# EasyEDA Pro project 21届智能车+蚂蚁搬家+主驱一体PCB文件.epro, schematic Schematic2

## Sheets
1 电源: Board Name: V2.0（20260103）; Create Date: 2025-12-08; Page Name: 电源; Project Name: NXP_micropython主驱一体20251208; Schematic Name: Schematic2; Update Date: 2026-01-03; BladeWidth: 10; Company: 嘉立创EDA; Page Size: A4; RegionStart: 1; ShowBorder: 1; TitleBlock: 1; TitleBlockPosition: 3; Version: V1.0; XRegionCount: 6; YRegionCount: 4
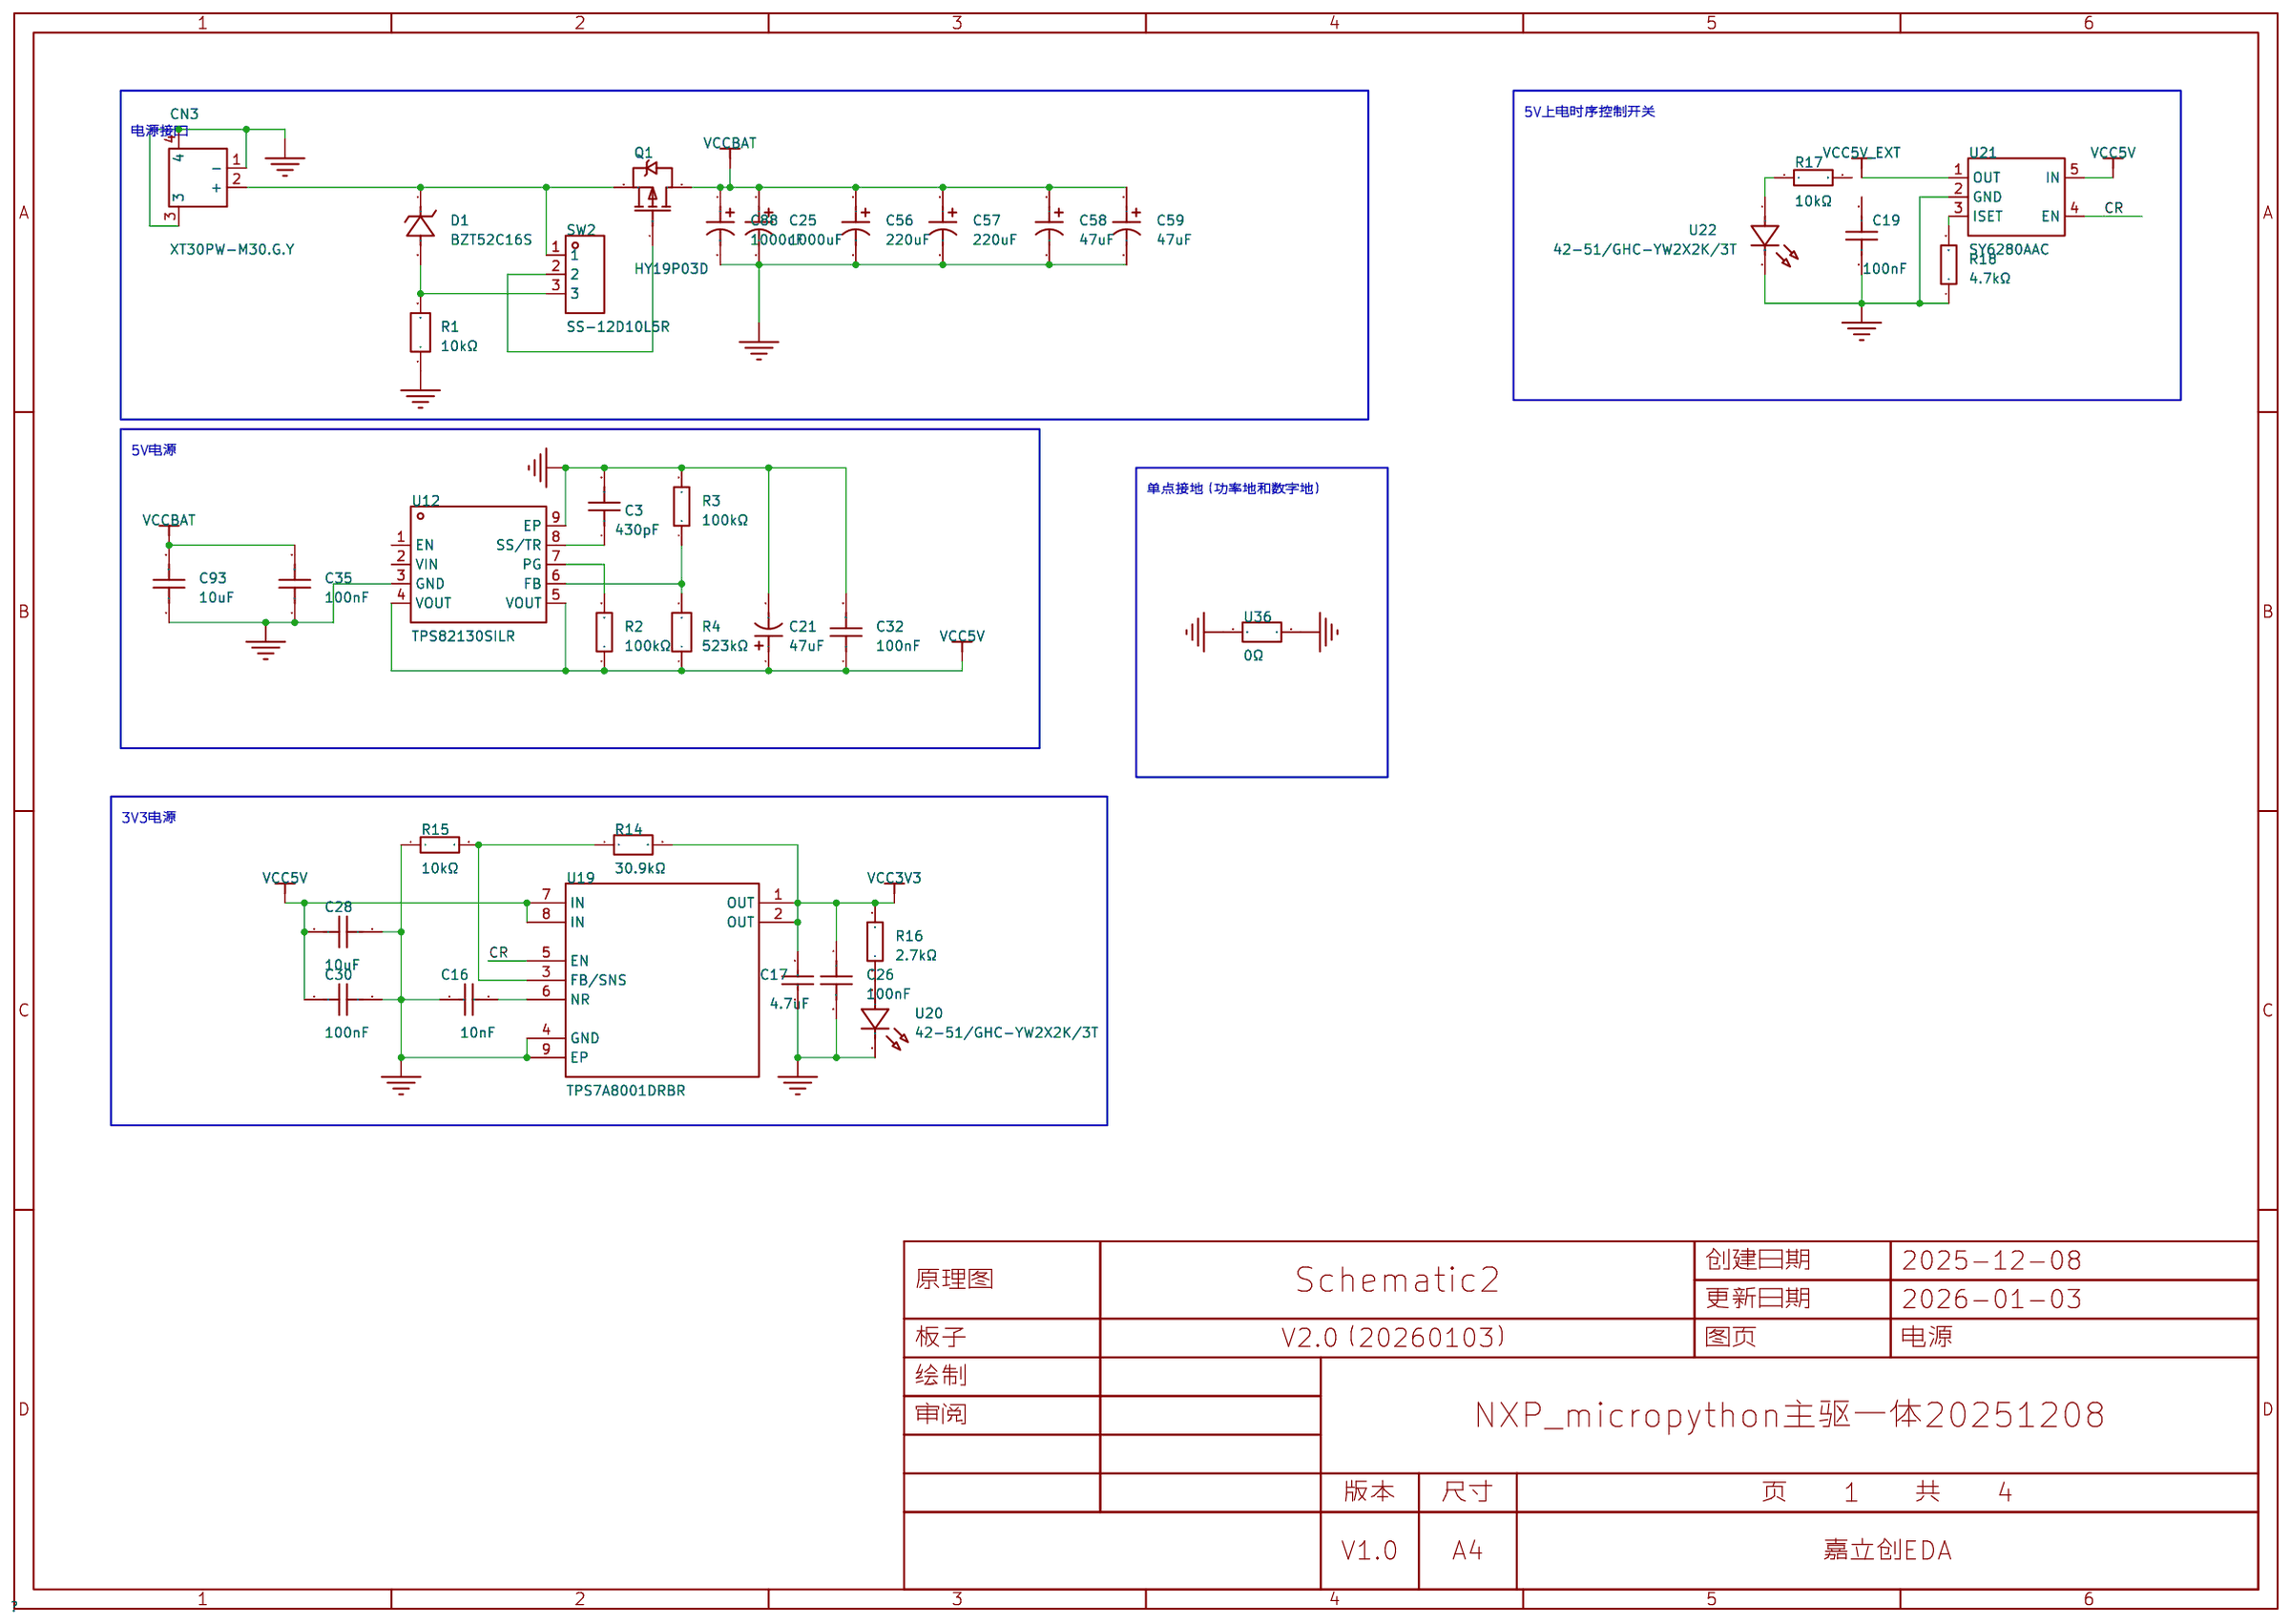
[diagram p23: 电源]
2 外设: Page Name: 外设; Update Date: 2026-01-04
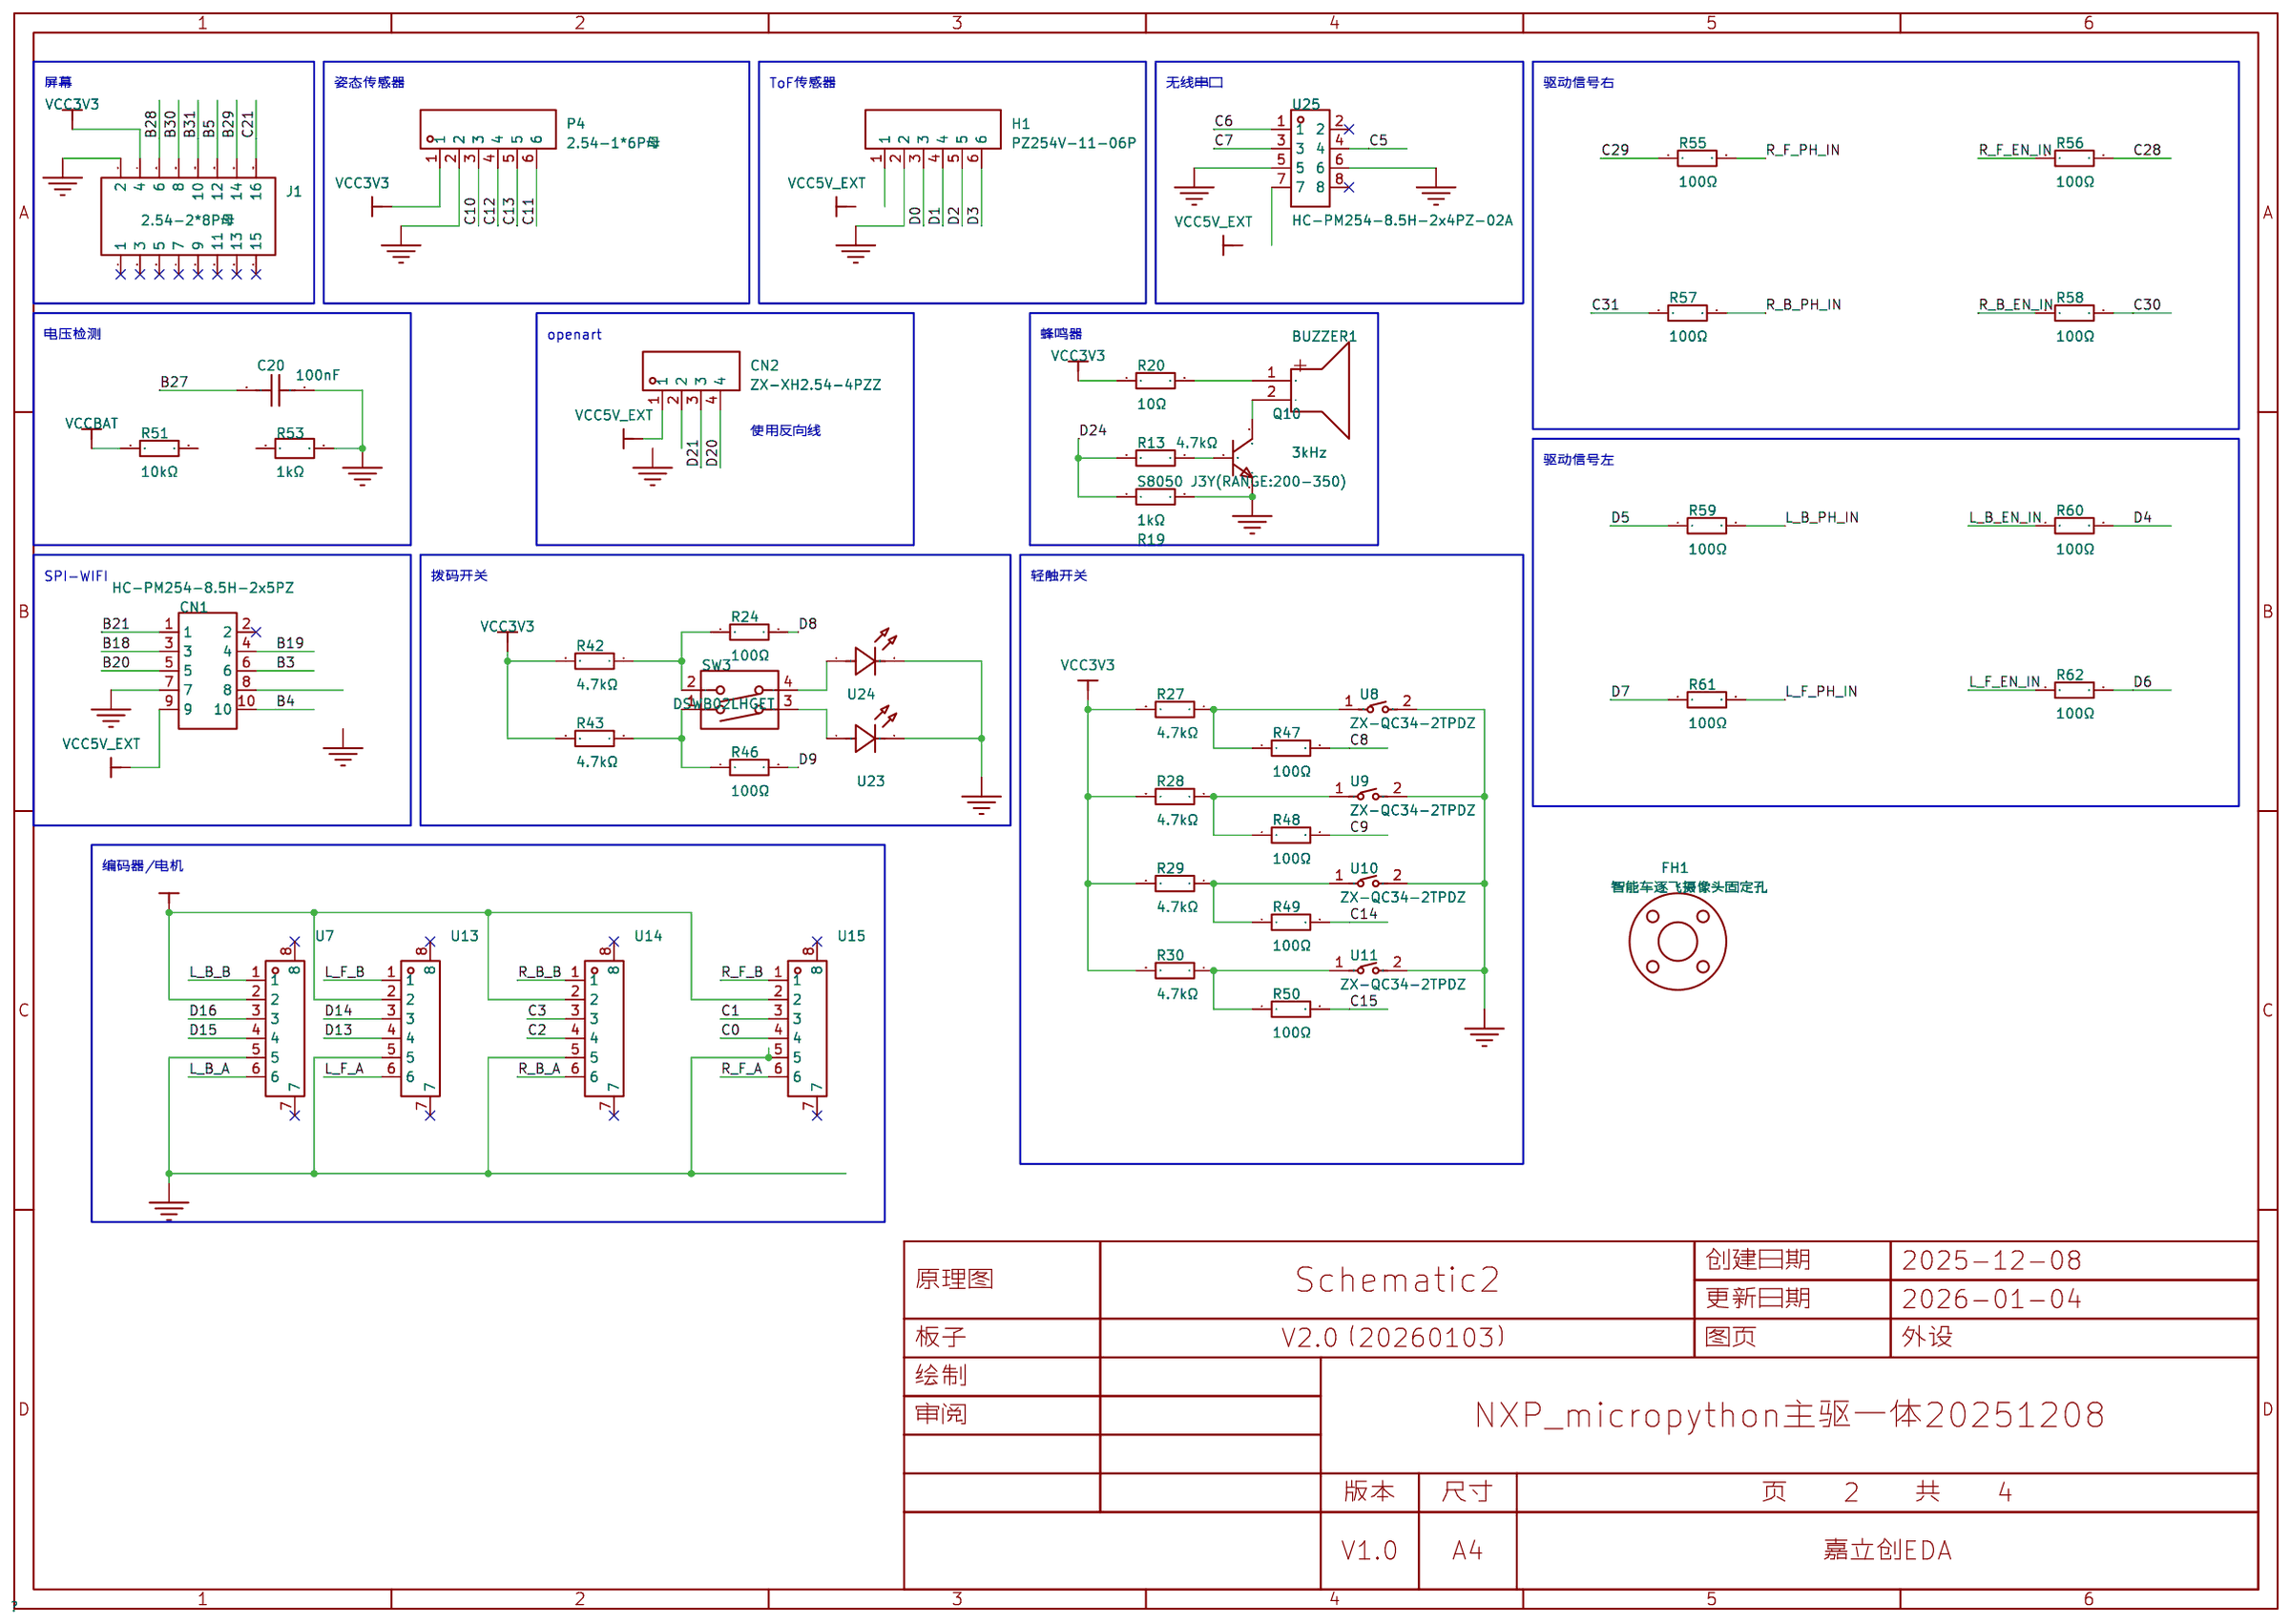
[diagram p24: 外设]
3 核心板: Page Name: 核心板; Update Date: 2026-01-04
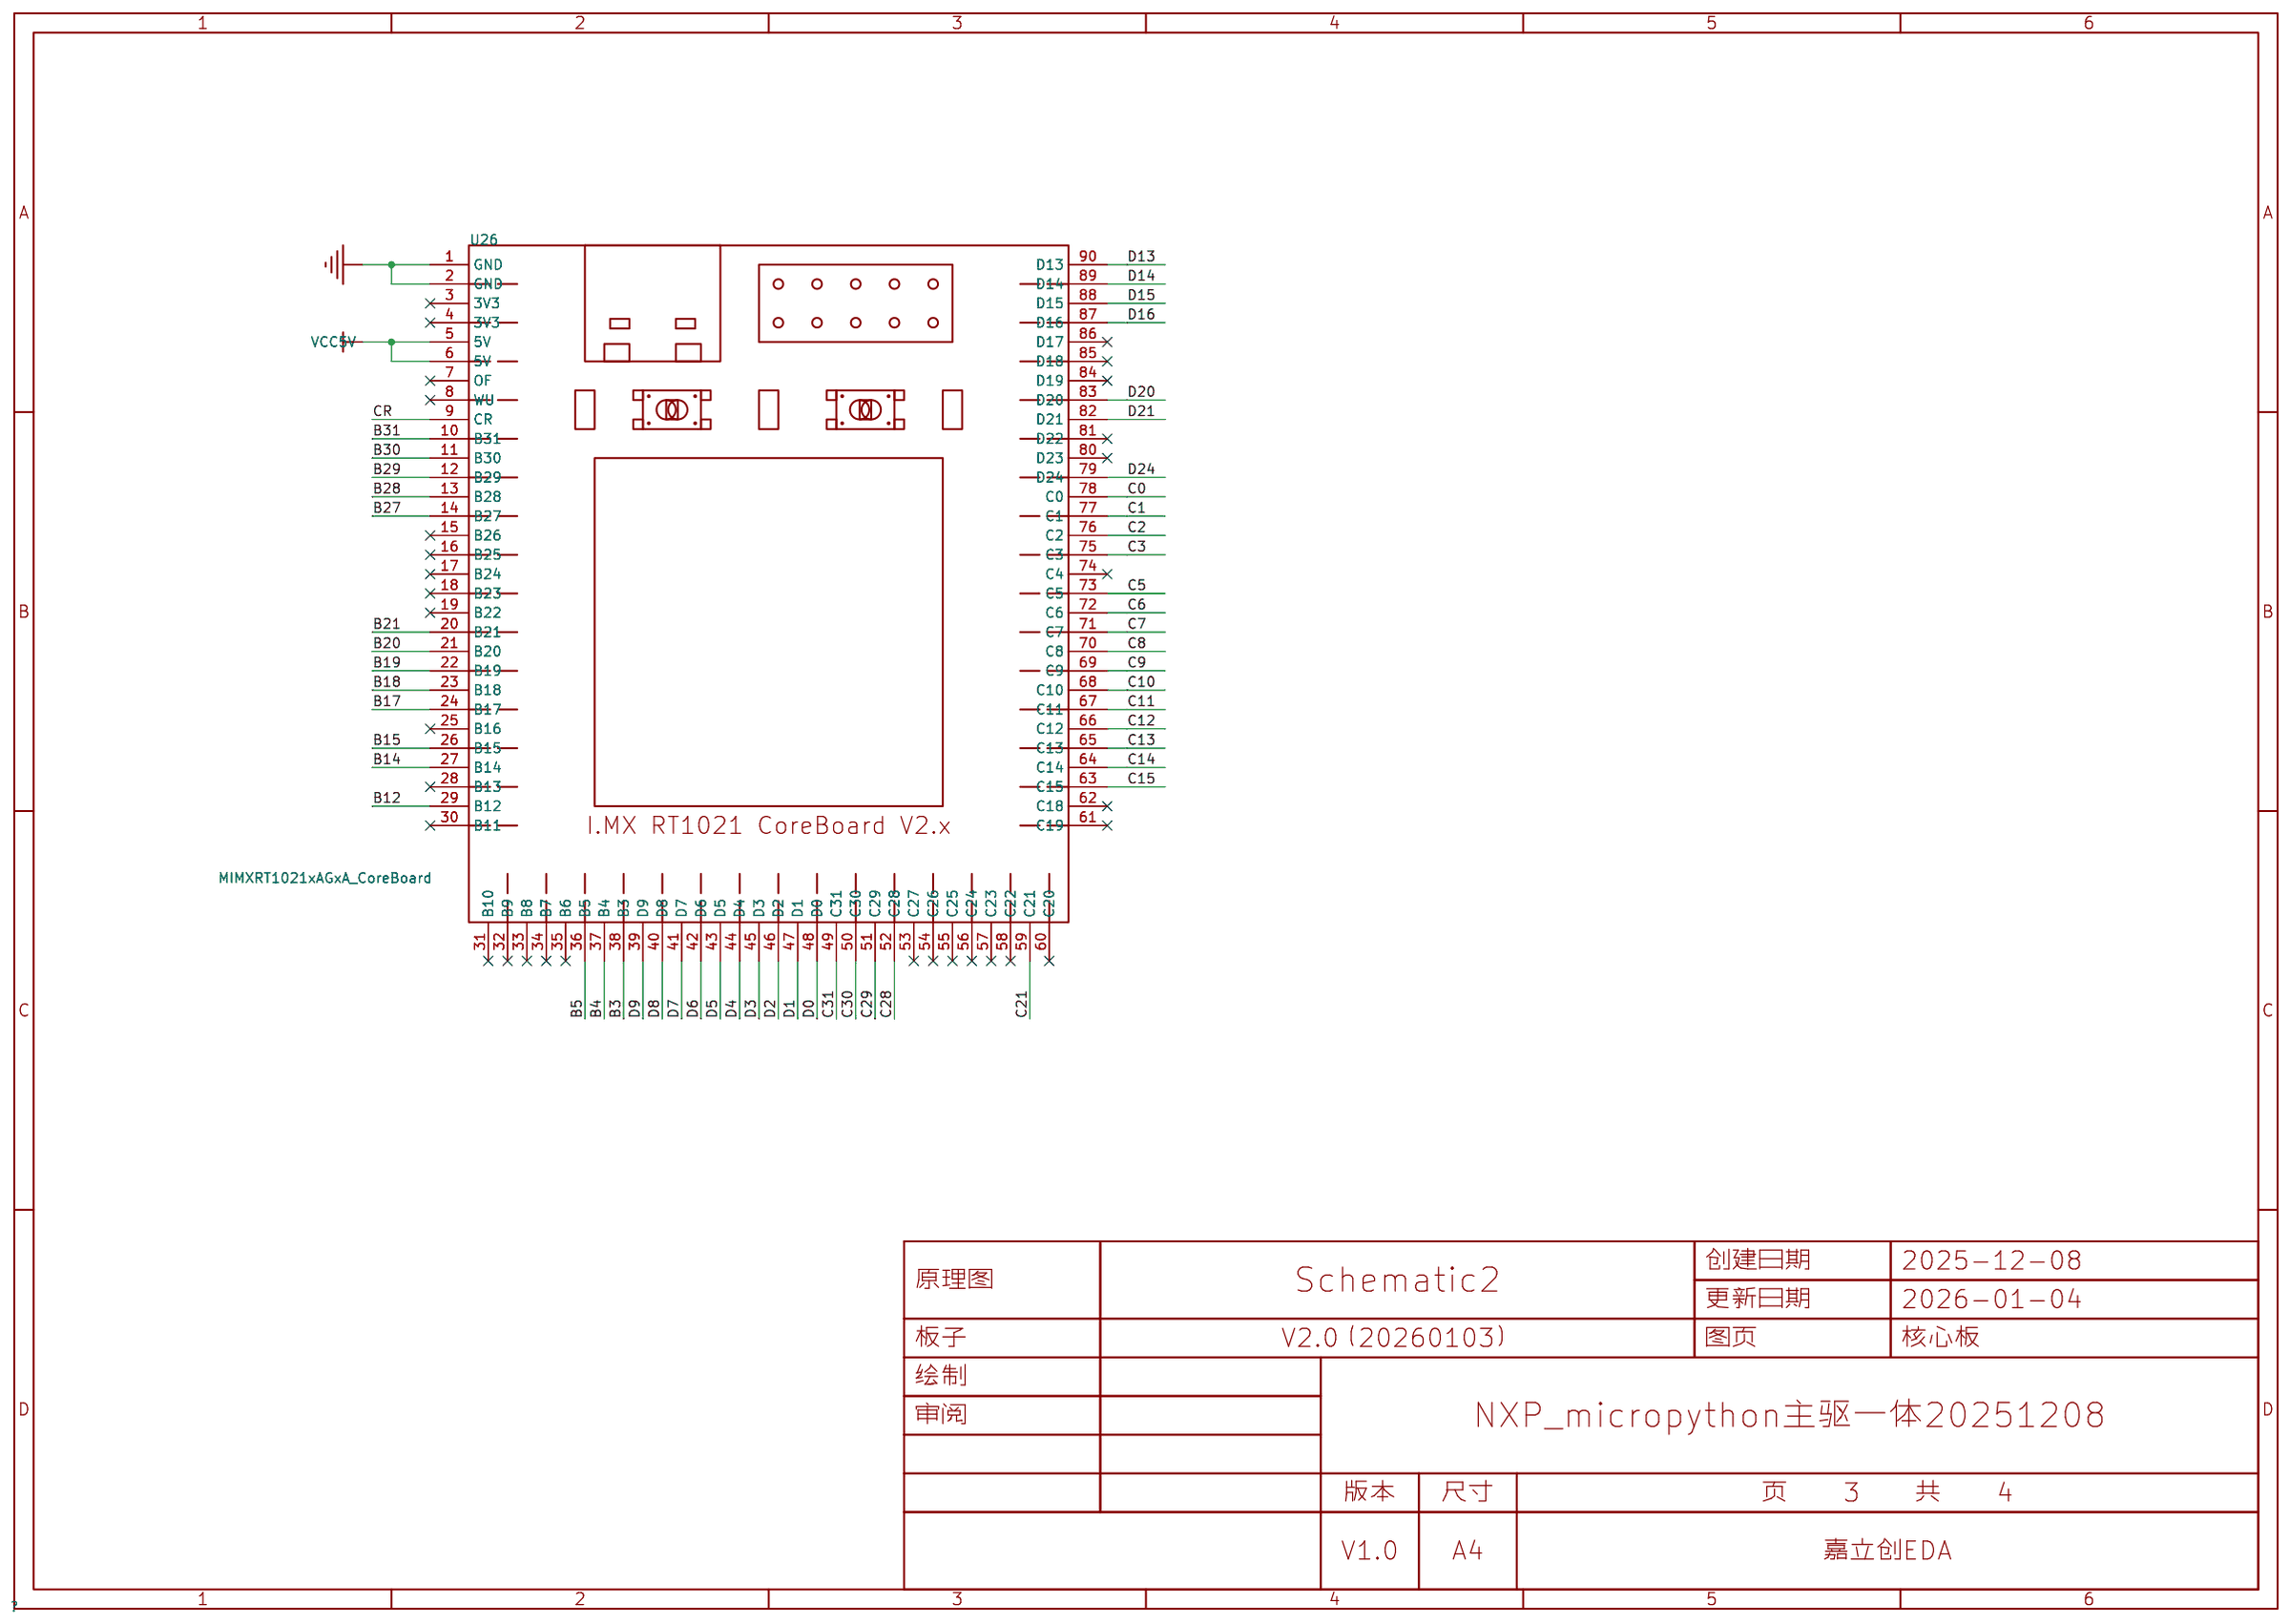
[diagram p25: 核心板]
4 双驱: Page Name: 双驱
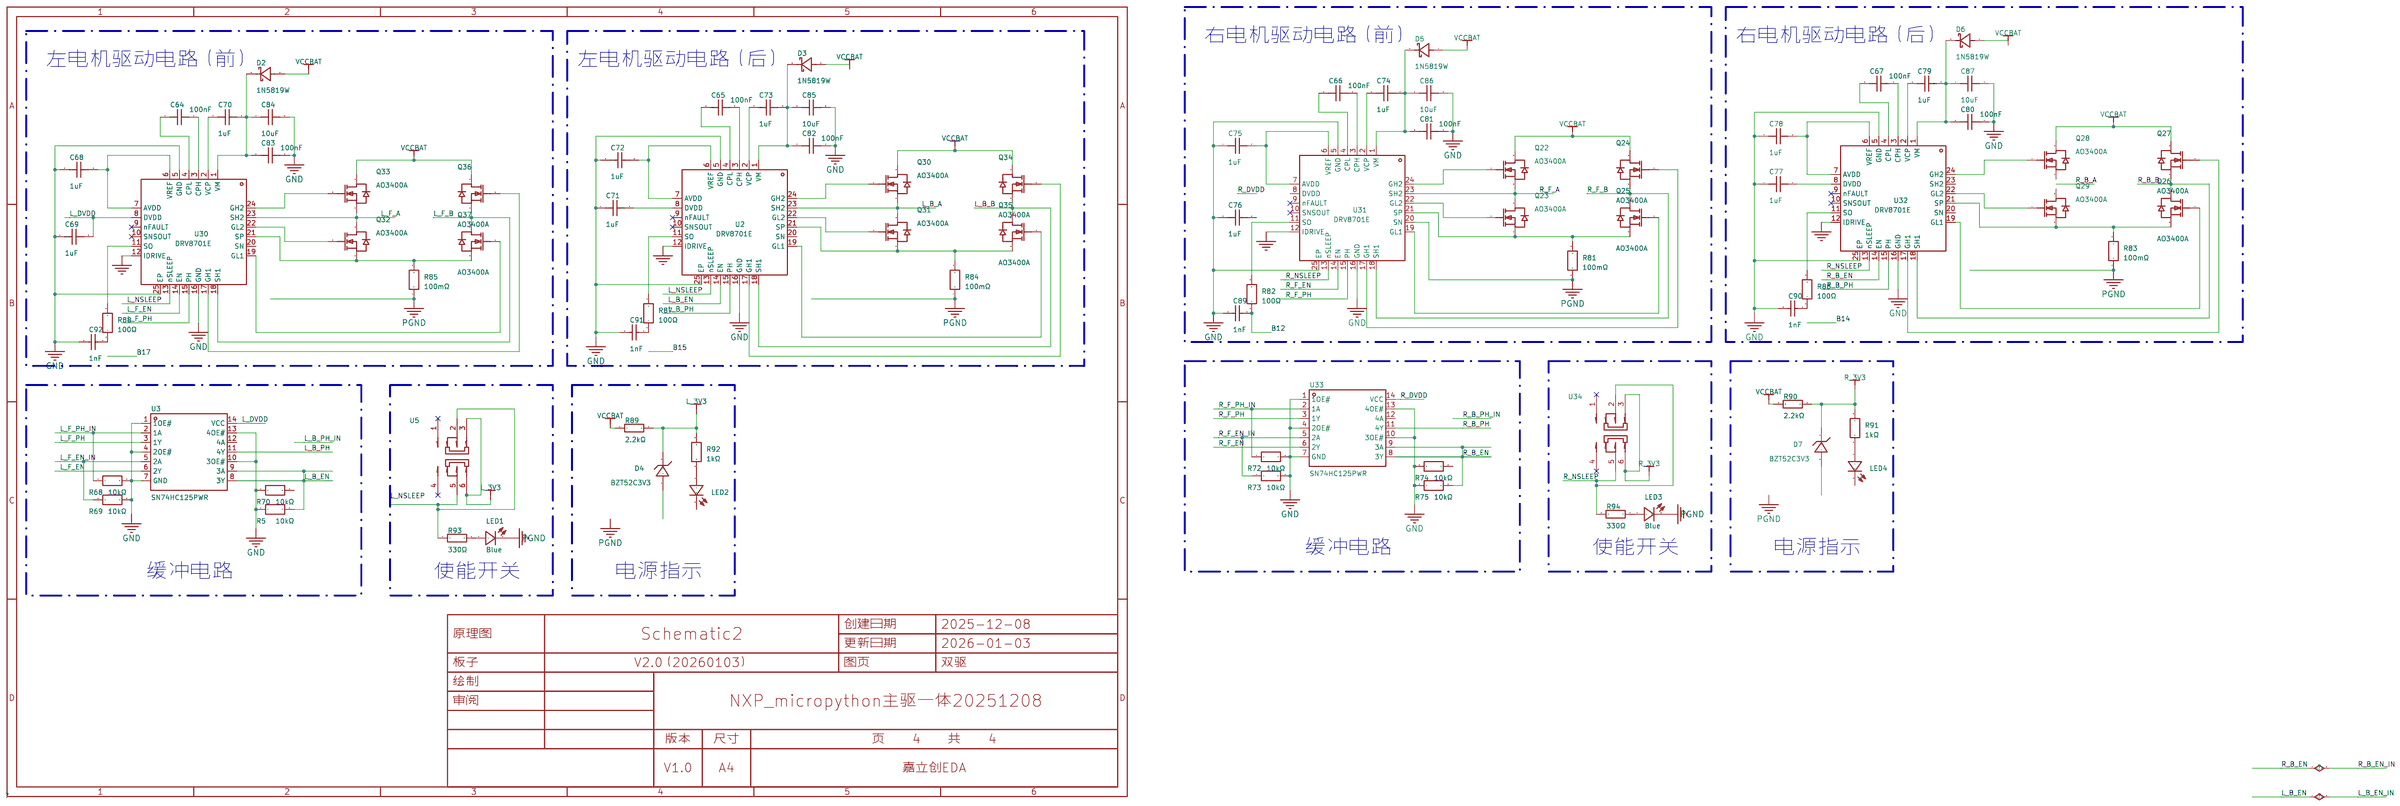
[diagram p26: 双驱]

## Parts
sheet 双驱
C64  100nF  [C0603]
C65  100nF  [C0603]
C66  100nF  [C0603]
C67  100nF  [C0603]
C68  1uF  [C0603]
C69  1uF  [C0603]
C70  1uF  [C0603]
C71  1uF  [C0603]
C72  1uF  [C0603]
C73  1uF  [C0603]
C74  1uF  [C0603]
C75  1uF  [C0603]
C76  1uF  [C0603]
C77  1uF  [C0603]
C78  1uF  [C0603]
C79  1uF  [C0603]
C80  100nF  [C0603]
C81  100nF  [C0603]
C82  100nF  [C0603]
C83  100nF  [C0603]
C84  10uF  [C0603]
C85  10uF  [C0603]
C86  10uF  [C0603]
C87  10uF  [C0603]
C89  1nF  [C0603]
C90  1nF  [C0603]
C91  1nF  [C0603]
C92  1nF  [C0603]
D2  1N5819W  [SOD-123_L2.7-W1.6-LS3.7-R-RD]
D3  1N5819W  [SOD-123_L2.7-W1.6-LS3.7-R-RD]
D4  BZT52C3V3  [SOD-123_L2.8-W1.8-LS3.7-RD]
D5  1N5819W  [SOD-123_L2.7-W1.6-LS3.7-R-RD]
D6  1N5819W  [SOD-123_L2.7-W1.6-LS3.7-R-RD]
D7  BZT52C3V3  [SOD-123_L2.8-W1.8-LS3.7-RD]
LED1  Blue  [LEDC1608(0603)]
LED2  =Color  [LEDC1608(0603)]
LED3  Blue  [LEDC1608(0603)]
LED4  =Color  [LEDC1608(0603)]
Q22  AO3400A  [SOT-23-3_L2.9-W1.3-P1.90-LS2.4-BR]
Q23  AO3400A  [SOT-23-3_L2.9-W1.3-P1.90-LS2.4-BR]
Q24  AO3400A  [SOT-23-3_L2.9-W1.3-P1.90-LS2.4-BR]
Q25  AO3400A  [SOT-23-3_L2.9-W1.3-P1.90-LS2.4-BR]
Q26  AO3400A  [SOT-23-3_L2.9-W1.3-P1.90-LS2.4-BR]
Q27  AO3400A  [SOT-23-3_L2.9-W1.3-P1.90-LS2.4-BR]
Q28  AO3400A  [SOT-23-3_L2.9-W1.3-P1.90-LS2.4-BR]
Q29  AO3400A  [SOT-23-3_L2.9-W1.3-P1.90-LS2.4-BR]
Q30  AO3400A  [SOT-23-3_L2.9-W1.3-P1.90-LS2.4-BR]
Q31  AO3400A  [SOT-23-3_L2.9-W1.3-P1.90-LS2.4-BR]
Q32  AO3400A  [SOT-23-3_L2.9-W1.3-P1.90-LS2.4-BR]
Q33  AO3400A  [SOT-23-3_L2.9-W1.3-P1.90-LS2.4-BR]
Q34  AO3400A  [SOT-23-3_L2.9-W1.3-P1.90-LS2.4-BR]
Q35  AO3400A  [SOT-23-3_L2.9-W1.3-P1.90-LS2.4-BR]
Q36  AO3400A  [SOT-23-3_L2.9-W1.3-P1.90-LS2.4-BR]
Q37  AO3400A  [SOT-23-3_L2.9-W1.3-P1.90-LS2.4-BR]
R5  10kΩ  [R0805]
R68  10kΩ  [R0805]
R69  10kΩ  [R0805]
R70  10kΩ  [R0805]
R72  10kΩ  [R0805]
R73  10kΩ  [R0805]
R74  10kΩ  [R0805]
R75  10kΩ  [R0805]
R81  100mΩ  [RES-SMD_L6.4-W3.2-R2512]
R82  100Ω  [R0603]
R83  100mΩ  [RES-SMD_L6.4-W3.2-R2512]
R84  100mΩ  [RES-SMD_L6.4-W3.2-R2512]
R85  100mΩ  [RES-SMD_L6.4-W3.2-R2512]
R86  100Ω  [R0603]
R87  100Ω  [R0603]
R88  100Ω  [R0603]
R89  2.2kΩ  [R0603]
R90  2.2kΩ  [R0603]
R91  1kΩ  [R0603]
R92  1kΩ  [R0603]
R93  330Ω  [R0603]
R94  330Ω  [R0603]
U2  DRV8701E  [VQFN-24_L4.0-W4.0-P0.50-BL-EP2.5]
U3  SN74HC125PWR  [TSSOP-14_L5.0-W4.4-P0.65-LS6.5-BL]
U5  SS-3235S-L1  [SW-SMD_SS-3235S-LX]
U30  DRV8701E  [VQFN-24_L4.0-W4.0-P0.50-BL-EP2.5]
U31  DRV8701E  [VQFN-24_L4.0-W4.0-P0.50-BL-EP2.5]
U32  DRV8701E  [VQFN-24_L4.0-W4.0-P0.50-BL-EP2.5]
U33  SN74HC125PWR  [TSSOP-14_L5.0-W4.4-P0.65-LS6.5-BL]
U34  SS-3235S-L1  [SW-SMD_SS-3235S-LX]
sheet 外设
BUZZER1  3kHz  [BUZ-TH_BD9.0-P5.00-D0.6-FD]
C20  100nF  [C0603]
CN1  HC-PM254-8.5H-2x5PZ  [HDR-TH_10P-P2.54-V-F-R2-C5-S2.54-1]
CN2  ZX-XH2.54-4PZZ  [CONN-TH_4P-P2.50_4PIN]
FH1  智能车逐飞摄像头固定孔  [智能车逐飞摄像头支架固定孔]
H1  PZ254V-11-06P  [HDR-TH_6P-P2.54-V-M]
J1  2.54-2*8P母  [HDR-TH_16P-P2.54-V-F-R2-C8-S2.54]
P4  2.54-1*6P母  [HDR-TH_6P-P2.54-V-F]
Q10  S8050 J3Y(RANGE:200-350)  [SOT-23-3_L3.0-W1.7-P0.95-LS2.9-BR]
R13  4.7kΩ  [R0603]
R19  1kΩ  [R0603]
R20  10Ω  [R0603]
R24  100Ω  [R0603]
R27  4.7kΩ  [R0603]
R28  4.7kΩ  [R0603]
R29  4.7kΩ  [R0603]
R30  4.7kΩ  [R0603]
R42  4.7kΩ  [R0603]
R43  4.7kΩ  [R0603]
R46  100Ω  [R0603]
R47  100Ω  [R0603]
R48  100Ω  [R0603]
R49  100Ω  [R0603]
R50  100Ω  [R0603]
R51  10kΩ  [R0603]
R53  1kΩ  [R0603]
R55  100Ω  [R0603]
R56  100Ω  [R0603]
R57  100Ω  [R0603]
R58  100Ω  [R0603]
R59  100Ω  [R0603]
R60  100Ω  [R0603]
R61  100Ω  [R0603]
R62  100Ω  [R0603]
SW3  DSWB02LHGET  [SW-TH_DSWB02LHGET]
U7  ZX-ZH1.5-6PWT  [CONN-SMD_6P-P1.50_ZX-ZH1.5-6PWT]
U8  ZX-QC34-2TPDZ  [KEY-SMD_L3.9-W3.0-LS5.0-EH]
U9  ZX-QC34-2TPDZ  [KEY-SMD_L3.9-W3.0-LS5.0-EH]
U10  ZX-QC34-2TPDZ  [KEY-SMD_L3.9-W3.0-LS5.0-EH]
U11  ZX-QC34-2TPDZ  [KEY-SMD_L3.9-W3.0-LS5.0-EH]
U13  ZX-ZH1.5-6PWT  [CONN-SMD_6P-P1.50_ZX-ZH1.5-6PWT]
U14  ZX-ZH1.5-6PWT  [CONN-SMD_6P-P1.50_ZX-ZH1.5-6PWT]
U15  ZX-ZH1.5-6PWT  [CONN-SMD_6P-P1.50_ZX-ZH1.5-6PWT]
U23  42-51/GHC-YW2X2K/3T  [LED-SMD_L1.6-W0.8-FD_GREEN-1]
U24  42-51/GHC-YW2X2K/3T  [LED-SMD_L1.6-W0.8-FD_GREEN-1]
U25  HC-PM254-8.5H-2x4PZ-02A  [HDR-TH_8P-P2.54-V-F-R2-C4-S2.54]
sheet 核心板
U26  MIMXRT1021xAGxA_CoreBoard  [MIMXRT1021xAGxA_CoreBoard_V2.x]
sheet 电源
C3  430pF  [C0603]
C16  10nF  [C0805]
C17  4.7uF  [C0805]
C19  100nF  [C0603]
C21  47uF  [CAP-SMD_BD5.0-L5.3-W5.3-LS5.9-FD]
C25  1000uF  [CAP-TH_BD10.0-P5.00-D0.6-FD]
C26  100nF  [C0603]
C28  10uF  [C0805]
C30  100nF  [C0603]
C32  100nF  [C0603]
C35  100nF  [C0603]
C56  220uF  [CAP-SMD_BD6.3-L6.6-W6.6-LS7.3-FD-H7.7]
C57  220uF  [CAP-SMD_BD6.3-L6.6-W6.6-LS7.3-FD-H7.7]
C58  47uF  [CAP-SMD_BD5.0-L5.3-W5.3-LS5.9-FD]
C59  47uF  [CAP-SMD_BD5.0-L5.3-W5.3-LS5.9-FD]
C88  1000uF  [CAP-TH_BD10.0-P5.00-D0.6-FD]
C93  10uF  [C0603]
CN3  XT30PW-M30.G.Y  [CONN-TH_XT30PW-M]
D1  BZT52C16S  [SOD-323_L1.7-W1.3-LS2.6-RD]
Q1  HY19P03D  [TO-252-2_L6.6-W6.1-P4.57-LS9.9-TL-CW]
R1  10kΩ  [R0603]
R2  100kΩ  [R0603]
R3  100kΩ  [R0603]
R4  523kΩ  [R0603]
R14  30.9kΩ  [R0603]
R15  10kΩ  [R0603]
R16  2.7kΩ  [R0603]
R17  10kΩ  [R0603]
R18  4.7kΩ  [R0603]
SW2  SS-12D10L5R  [SW-TH_SS-12D10L9]
U12  TPS82130SILR  [USIP-8_L3.0-W2.8-P0.65-TL-EP]
U19  TPS7A8001DRBR  [VSON-8_L3.0-W3.0-P0.65-TL-EP]
U20  42-51/GHC-YW2X2K/3T  [LED-SMD_L1.6-W0.8-FD_GREEN-1]
U21  SY6280AAC  [SOT-23-5_L3.0-W1.7-P0.95-LS2.8-BR]
U22  42-51/GHC-YW2X2K/3T  [LED-SMD_L1.6-W0.8-FD_GREEN-1]
U36  0Ω  [R1206]

## Library data of the parts
C19 C20 C26 C30 C32 C35 C64-C67 C80-C83 = CL10B104KB8NNNC: 容值:100nF;精度:±10%;额定电压:50V;温度系数:X7R;; LCSC Part Name: 100nF ±10% 50V; Supplier Part: C1591; Manufacturer: SAMSUNG(三星); Supplier Footprint: 0603; JLCPCB Part Class: 扩展库; Datasheet: https://item.szlcsc.com/datasheet/CL10B104KB8NNNC/1943.html; Supplier: LCSC; Tolerance: ±10%; Voltage Rating: 50V; Temperature Coefficient: X7R
C68-C79 = CGA0603X5R105K500JT: 容值:1uF;精度:±10%;额定电压:50V;温度系数:X5R;; LCSC Part Name: 1uF ±10% 50V; Supplier Part: C6119852; Manufacturer: HRE(芯声); Supplier Footprint: 0603; JLCPCB Part Class: 扩展库; Datasheet: https://item.szlcsc.com/datasheet/CGA0603X5R105K500JT/7062558.html; Supplier: LCSC; Tolerance: ±10%; Voltage Rating: 50V; Temperature Coefficient: X5R
C84-C87 C93 = CL10A106MA8NRNC: 容值:10uF;精度:±20%;额定电压:25V;温度系数:X5R;; LCSC Part Name: 10uF ±20% 25V; Supplier Part: C96446; Manufacturer: SAMSUNG(三星); Supplier Footprint: 0603; JLCPCB Part Class: 基础库; Datasheet: https://item.szlcsc.com/datasheet/CL10A106MA8NRNC/97651.html; Supplier: LCSC; Tolerance: ±20%; Voltage Rating: 25V; Temperature Coefficient: X5R
C89-C92 = CL10B102KB8NNNC: 容值:1nF;精度:±10%;额定电压:50V;温度系数:X7R;; LCSC Part Name: 1nF ±10% 50V; Supplier Part: C1588; Manufacturer: SAMSUNG(三星); Supplier Footprint: 0603; JLCPCB Part Class: 基础库; Datasheet: https://item.szlcsc.com/datasheet/CL10B102KB8NNNC/1940.html; Supplier: LCSC; Tolerance: ±10%; Voltage Rating: 50V; Temperature Coefficient: X7R
D2 D3 D5 D6 = 1N5819W_C963381: 二极管配置:独立式;直流反向耐压(Vr):40V;平均整流电流(Io):350mA;正向压降(Vf):600mV@200mA;反向电流(Ir):5uA@30V;; LCSC Part Name: 40V 350mA 600mV@200mA; Supplier Part: C963381; Manufacturer: JSMSEMI(杰盛微); Supplier Footprint: SOD-123; JLCPCB Part Class: 扩展库; Datasheet: https://atta.szlcsc.com/upload/public/pdf/source/20211201/C266112E93E924DFE0C071C9A8E85281.pdf; Supplier: LCSC; Diode Configuration: 独立式; Reverse Voltage (Vr): 40V; Average Rectified Current (Io): 350mA; Forward Voltage (Vf@If): 600mV@200mA; Reverse Leakage Current (Ir): 5uA@30V
D4 D7 = BZT52C3V3_C2112: 二极管配置:独立式;稳压值(标称值):3.3V;稳压值(范围):3.1V~3.5V;精度:-;功率:350mW;反向电流(Ir):5uA@1V;阻抗(Zzt):95Ω;; LCSC Part Name: 3.3V 350mW; Supplier Part: C2112; Manufacturer: CJ(江苏长电/长晶); Supplier Footprint: SOD-123; JLCPCB Part Class: Extended Part; Datasheet: https://atta.szlcsc.com/upload/public/pdf/source/20170919/C2112_1505799672426977594.pdf; Supplier: LCSC; Diode Configuration: 独立式; Zener Voltage (Nom): 3.3V; Zener Voltage (Range): 3.1V~3.5V; Power Dissipation: 350mW; Reverse Leakage Current (Ir): 5uA@1V; Zener Impedance (Zzt): 95Ω
LED1 LED3 = LED Chip Blue: Published: 8-Jun-2000; Revision: July-2002: Re-released for DXP Platform.; Publisher: Altium Limited; Price(RMB): 0.00; Origin Footprint 2: LEDC2012(0805); Origin Footprint 3: LEDC3216(1206)
LED2 LED4 = LED Chip Red: Published: 8-Jun-2000; Revision: July-2002: Re-released for DXP Platform.; Publisher: Altium Limited; Price(RMB): 0.00; Origin Footprint 2: LEDC2012(0805); Origin Footprint 3: LEDC3216(1206)
Q22-Q37 = AO3400A_C20917: 数量:-;漏源电压(Vdss):30V;连续漏极电流(Id):-;导通电阻(RDS(on)):48mΩ@2.5V;耗散功率(Pd):-;阈值电压(Vgs(th)):1.45V@250uA;; LCSC Part Name: 1个N沟道 耐压:30V 电流:5.7A; Supplier Part: C20917; Manufacturer: AOS; Supplier Footprint: SOT-23-3L; JLCPCB Part Class: 基础库; Datasheet: https://item.szlcsc.com/datasheet/AO3400A/21629.html; Supplier: LCSC; Drain to Source Voltage: 30V; RDS(on): 48mΩ@2.5V; Gate Threshold Voltage (Vgs(th)): 1.45V@250uA; Gate Charge(Qg): 7nC@10V; Input Capacitance(Ciss): 630pF@15V; Operating Temperature: -55℃~+150℃@(Tj); Type: N沟道
R5 R68-R70 R72-R75 = ERJP06J103V: 阻值:10kΩ;精度:±5%;功率:500mW;温度系数:±200ppm/℃;最大工作电压:600V;工作温度范围:-55℃~+155℃;; LCSC Part Name: 10kΩ ±5% 500mW; Supplier Part: C441955; Manufacturer: PANASONIC(松下); Supplier Footprint: 0805; JLCPCB Part Class: Extended Part; Supplier: LCSC; Tolerance: ±5%; Power(Watts): 500mW; Temperature Coefficient: ±200ppm/℃; Overload Voltage (Max): 600V; Operating Temperature Range: -55℃~+155℃
R81 R83-R85 = HoJLR2512-3W-100mR-1%: 电阻类型:采样电阻;阻值:100mΩ;精度:±1%;功率:3W;安装方式:贴片;; LCSC Part Name: 100mΩ ±1% 3W; Supplier Part: C2903476; Manufacturer: Milliohm(毫欧); Supplier Footprint: 2512; JLCPCB Part Class: 扩展库; Datasheet: https://item.szlcsc.com/datasheet/HoJLR2512-3W-100mR-1%2525/3159230.html; Supplier: LCSC; Type: 采样电阻; Tolerance: ±1%; Power(Watts): 3W; Mounting Type: 贴片
R82 R86-R88 = RCA03100RJLF: 阻值:100Ω;精度:±5%;功率:100mW;; LCSC Part Name: 100Ω ±5% 100mW; Supplier Part: C22356621; Manufacturer: HKR(香港电阻); Supplier Footprint: 0603; JLCPCB Part Class: 扩展库; Datasheet: https://item.szlcsc.com/datasheet/RCA03100RJLF/23790065.html; Supplier: LCSC; Tolerance: ±5%; Power(Watts): 100mW
R89 R90 = 0603WAF2201T5E: 电阻类型:厚膜电阻;阻值:2.2kΩ;精度:±1%;功率:100mW;最大工作电压:75V;温度系数:±100ppm/℃;; LCSC Part Name: 2.2kΩ ±1% 100mW 厚膜电阻; Supplier Part: C4190; Manufacturer: UNI-ROYAL(厚声); Supplier Footprint: 0603; JLCPCB Part Class: 基础库; Datasheet: https://atta.szlcsc.com/upload/public/pdf/source/20200306/C422600_1E6D84923E4A46A82E41ADD87F860B5C.pdf; Supplier: LCSC; Type: 厚膜电阻; Tolerance: ±1%; Power(Watts): 100mW; Overload Voltage (Max): 75V; Temperature Coefficient: ±100ppm/℃; Operating Temperature Range: -55℃~+155℃
R53 R91 R92 = FRC0603F1001TS: 电阻类型:厚膜电阻;阻值:1kΩ;精度:±1%;功率:100mW;工作电压:75V;温度系数:±100ppm/℃;; LCSC Part Name: 1kΩ ±1% 100mW 厚膜电阻; Supplier Part: C2907002; Manufacturer: FOJAN(富捷); Supplier Footprint: 0603; JLCPCB Part Class: 扩展库; Supplier: LCSC; Type: 厚膜电阻; Tolerance: ±1%; Power(Watts): 100mW; Voltage-Supply(Max): 75V; Temperature Coefficient: ±100ppm/℃; Operating Temperature: -55℃~+155℃
R93 R94 = 0603WAF3300T5E: 电阻类型:厚膜电阻;阻值:330Ω;精度:±1%;功率:100mW;最大工作电压:75V;温度系数:±100ppm/℃;; LCSC Part Name: 330Ω ±1% 100mW 厚膜电阻; Supplier Part: C23138; Manufacturer: UNI-ROYAL(厚声); Supplier Footprint: 0603; JLCPCB Part Class: 基础库; Datasheet: https://atta.szlcsc.com/upload/public/pdf/source/20200306/C422600_1E6D84923E4A46A82E41ADD87F860B5C.pdf; Supplier: LCSC; Type: 厚膜电阻; Tolerance: ±1%; Power(Watts): 100mW; Overload Voltage (Max): 75V; Temperature Coefficient: ±100ppm/℃; Operating Temperature Range: -55℃~+155℃
U2 U30-U32 = DRV8701ERGET: 电源电压:0V~5.5V;输出电流:-;接口:并行;; Supplier Part: C132049; Manufacturer: TI(德州仪器); Supplier Footprint: VQFN-24(4x4); JLCPCB Part Class: Extended Part; Datasheet: https://atta.szlcsc.com/upload/public/pdf/source/20170925/C132049_1506321643935990409.pdf; Supplier: LCSC; Type: 有刷直流电机; Supply Voltage: 0V~5.5V; Interface: 并行; Operating Temperature: -40℃~+125℃@(Ta)
U3 U33 = SN74HC125PWR: 类型:缓冲器，非反相;电源电压:2V~6V;输入类型:-;输出类型:三态;低电平输出电流(IOL):7.8mA;高电平输出电流(IOH):7.8mA;工作温度:-40℃~+85℃;; Supplier Part: C132994; Manufacturer: TI(德州仪器); Supplier Footprint: TSSOP-14; JLCPCB Part Class: Extended Part; Datasheet: https://atta.szlcsc.com/upload/public/pdf/source/20170930/C132994_1506736365150997346.pdf; Supplier: LCSC; Type: 缓冲器，非反相; Supply Voltage: 2V~6V; output type: 三态; Current-OutputLow: 7.8mA; Current-OutputHigh: 7.8mA; Operating temperature: -40℃~+85℃
U5 U34 = SS-3235S-L1: 电路结构:双刀双掷;安装方式:卧贴;开关颜色:黑色;额定电流:50mA;额定电压:12V;工作寿命:1万次;; LCSC Part Name: 柄长2mm 卧贴双档 滑动开关; Supplier Part: C500055; Manufacturer: XKB Connection(中国星坤); Supplier Footprint: SMD,9.1x3.6mm; JLCPCB Part Class: 扩展库; Datasheet: https://item.szlcsc.com/datasheet/SS-3235S-L1/512181.html; Supplier: LCSC; Circuit: 双刀双掷; Actuator Style: 矩形柱状; Termination Style: 鸥翼型; Length: 9.1mm; Width: 3.55mm; Switch Height: 3.2mm; Mounting Type: 卧贴; Actuator Color: 黑色; Current Rating: 50mA; Voltage Rating: 12V; Life: 1万次; Operating Temperature: -40℃~+85℃
BUZZER1 = HNB09A03: 驱动方式:有源(内含驱动线路);构造类型:电磁式;频率:3kHz;声压(SPL):85dB;; LCSC Part Name: 电磁式有源一体蜂鸣器HNB09A03; Supplier Part: C96102; Manufacturer: 华能; Supplier Footprint: 插件,D=9mm; JLCPCB Part Class: 扩展库; Datasheet: https://atta.szlcsc.com/upload/public/pdf/source/20241128/61C4C8C3938BB25F7C38FBE94CCE8DCF.pdf; Supplier: LCSC; Driver Circuitry: 有源(内含驱动线路); Technology: 电磁式; Voltage - Supply: 1.5V~4.5V; Current Consumption: 30mA; Sound Pressure Level(SPL): 85dB; Diameter(φD): 9mm; Height: 5.5mm; Operating Temperature: -20℃~+70℃
CN1 = HC-PM254-8.5H-2x5PZ: 插孔结构:2x5P;间距:2.54mm;行距:2.54mm;圆孔/方孔:方孔;安装方式:直插;排数:双排;总孔位数:10P;额定电流:3A;额定电压:-;插孔方向:顶部;塑高:8.5mm;触头材质:黄铜;触头镀层:金;工作温度:-40℃~+105℃;; LCSC Part Name: 间距2.54mm 2x5Pin 直插 PC3.0 H8.5; Supplier Part: C22373910; Manufacturer: HC(虹成电子); Supplier Footprint: 插件,P=2.54mm; JLCPCB Part Class: 扩展库; Datasheet: https://item.szlcsc.com/datasheet/HC-PM254-8.5H-2x5PZ/23870246.html; Supplier: LCSC; Holes Structure: 2x5P; Pitch: 2.54mm; Row Spacing: 2.54mm; Circular Hole / Square Hole: 方孔; Mounting Type: 直插; Number of Rows: 双排; Number of Positions: 10P; Current Rating: 3A; Holes Direction: 顶部; Insulation Height: 8.5mm; Contact Material: 黄铜; Contact Plating: 金; Operating Temperature: -40℃~+105℃; PIN Length: 3mm
CN2 = ZX-XH2.54-4PZZ: 插针结构:1x4P;间距:2.5mm;安装方式:直插;参考系列:XH;总PIN数:4P;排数:1;每排PIN数:4;行距:-;额定电流:3A;触头材质:黄铜;触头镀层:锡;工作温度:-25℃~+85℃;; LCSC Part Name: 1x4P 间距:2.5mm 直插 系列:XH; Supplier Part: C7429634; Manufacturer: Megastar(兆星); Supplier Footprint: 插件,P=2.5mm; JLCPCB Part Class: 扩展库; Datasheet: https://item.szlcsc.com/datasheet/ZX-XH2.54-4PZZ/8427551.html; Supplier: LCSC; Pins Structure: 1x4P; Pitch: 2.5mm; Mounting Type: 直插; Reference Series: XH; Number of Pins: 4P; Number of Rows: 1; Number of PINs Per Row: 4; Current Rating: 3A; Contact Material: 黄铜; Contact Plating: 锡; Operating Temperature: -25℃~+85℃; Voltage Rating: 250V; Plastic Material: PA66; Flame Retardant Rating: UL94V-0; Color: 白色; Z-Height of the Board: 7mm; X-Length of Bottom Edge on Board (Spacing Line): 12.5mm; Y-Width of Bottom Edge on Board: 5.9mm
FH1 = 智能车逐飞摄像头固定孔: 3DModel: 逐飞摄像头法兰盘-Body
H1 = PZ254V-11-06P: 插针结构:1x6P;间距:2.54mm;行距:-;圆针/方针:方针;安装方式:直插;排数:单排;总PIN位数:6P;额定电流:-;额定电压:-;配合针长度:6mm;塑高:2.5mm;端接针长度:3mm;触头材质:黄铜;触头镀层:-;工作温度:-40℃~+105℃;颜色:黑色;; LCSC Part Name: 1x6P 间距:2.54mm 方针 直插; Supplier Part: C492405; Manufacturer: XFCN(兴飞); Supplier Footprint: 插件,P=2.54mm; JLCPCB Part Class: 扩展库; Datasheet: https://atta.szlcsc.com/upload/public/pdf/source/20200309/C492405_597F1930F5B55CC3C7FD95458F1C3977.pdf; Supplier: LCSC; Pin Structure: 1x6P; Pitch: 2.54mm; Circluar Pins/Square Pins: 方针; Mounting Type: 直插; Number of Rows: 单排; Number of Pins: 6P; Length of Mating Pin: 6mm; Insulation Height: 2.5mm; Length of End Connection Pin: 3mm; Contact Material: 黄铜; Operating Temperature: -40℃~+105℃; Color: 黑色
J1 = 2.54-2*8P母: 插孔结构:2x8P;间距:2.54mm;行距:2.54mm;圆孔/方孔:方孔;安装方式:直插;排数:双排;总孔位数:16P;插孔方向:顶部;塑高:-;触头材质:黄铜;触头镀层:-;; LCSC Part Name: 2x8P 间距:2.54mm 直插; Supplier Part: C30734; Manufacturer: BOOMELE(博穆精密); Supplier Footprint: 插件,P=2.54mm; JLCPCB Part Class: 扩展库; Datasheet: https://item.szlcsc.com/datasheet/2.54-2*8P%25E6%25AF%258D/31491.html; Supplier: LCSC; Holes Structure: 2x8P; Pitch: 2.54mm; Row Spacing: 2.54mm; Circular Hole / Square Hole: 方孔; Mounting Type: 直插; Number of Rows: 双排; Number of Positions: 16P; Holes Direction: 顶部; Contact Material: 黄铜
P4 = 2.54-1*6P母: 插孔结构:1x6P;间距:2.54mm;行距:-;圆孔/方孔:方孔;安装方式:直插;排数:单排;总孔位数:6P;额定电流:3A;额定电压:-;插孔方向:顶部;塑高:-;触头材质:黄铜;触头镀层:-;工作温度:-40℃~+105℃;; LCSC Part Name: 1x6P 间距:2.54mm 直插; Supplier Part: C40877; Manufacturer: BOOMELE(博穆精密); Supplier Footprint: 插件,P=2.54mm; JLCPCB Part Class: 扩展库; Datasheet: https://item.szlcsc.com/datasheet/2.54-1*6P%25E6%25AF%258D/41861.html; Supplier: LCSC; Holes Structure: 1x6P; Pitch: 2.54mm; Circular Hole / Square Hole: 方孔; Mounting Type: 直插; Number of Rows: 单排; Number of Positions: 6P; Current Rating: 3A; Holes Direction: 顶部; Contact Material: 黄铜; Operating Temperature: -40℃~+105℃; PIN Length: 3.3mm
Q10 = S8050 J3Y(RANGE:200-350): 晶体管类型:NPN;集电极电流(Ic):500mA;集射极击穿电压(Vceo):25V;功率(Pd):300mW;直流电流增益(hFE@Ic,Vce):200@500mA,1V;; LCSC Part Name: NPN 电流:500mA 耐压:25V H档(200-350); Supplier Part: C2146; Manufacturer: CJ(江苏长电/长晶); Supplier Footprint: SOT-23; JLCPCB Part Class: 基础库; Datasheet: https://atta.szlcsc.com/upload/public/pdf/source/20231013/FF37B6A000E6CDA75C9C999D2E78731F.pdf; Supplier: LCSC; Transistor Type: NPN; Collector Current (Ic): 500mA; Collector-Emitter Breakdown Voltage (Vceo): 25V; Power Dissipation (Pd): 300mW; DC Current Gain (hFE@Ic,Vce): 200@500mA,1V; Transition Frequency (fT): 150MHz; Collector Cut-Off Current (Icbo): 100nA; Collector-Emitter Saturation Voltage (VCE(sat)@Ic,Ib): 600mV@500mA,50mA; Operating Temperature: -55℃~+150℃
R13 R18 R27-R30 R42 R43 = 0603WAF4701T5E: 电阻类型:厚膜电阻;阻值:4.7kΩ;精度:±1%;功率:100mW;最大工作电压:75V;温度系数:±100ppm/℃;; LCSC Part Name: 4.7kΩ ±1% 100mW 厚膜电阻; Supplier Part: C23162; Manufacturer: UNI-ROYAL(厚声); Supplier Footprint: 0603; JLCPCB Part Class: 基础库; Datasheet: https://atta.szlcsc.com/upload/public/pdf/source/20200306/C422600_1E6D84923E4A46A82E41ADD87F860B5C.pdf; Supplier: LCSC; Type: 厚膜电阻; Tolerance: ±1%; Power(Watts): 100mW; Overload Voltage (Max): 75V; Temperature Coefficient: ±100ppm/℃; Operating Temperature Range: -55℃~+155℃
R19 = RT0603BRD071KL: 电阻类型:薄膜电阻;阻值:1kΩ;精度:±0.1%;功率:100mW;最大工作电压:75V;温度系数:±25ppm/℃;; LCSC Part Name: 薄膜电阻 1kΩ ±0.1% 100mW; Supplier Part: C110776; Manufacturer: YAGEO(国巨); Supplier Footprint: 0603; JLCPCB Part Class: 扩展库; Datasheet: https://atta.szlcsc.com/upload/public/pdf/source/20170704/1499151282044.pdf; Supplier: LCSC; Type: 薄膜电阻; Tolerance: ±0.1%; Power(Watts): 100mW; Overload Voltage (Max): 75V; Temperature Coefficient: ±25ppm/℃; Operating Temperature Range: -55℃~+155℃
R20 = 0603WAF100JT5E: 电阻类型:厚膜电阻;阻值:10Ω;精度:±1%;功率:100mW;最大工作电压:75V;温度系数:±400ppm/℃;; LCSC Part Name: 10Ω ±1% 100mW 厚膜电阻; Supplier Part: C22859; Manufacturer: UNI-ROYAL(厚声); Supplier Footprint: 0603; JLCPCB Part Class: 基础库; Datasheet: https://atta.szlcsc.com/upload/public/pdf/source/20200306/C422600_1E6D84923E4A46A82E41ADD87F860B5C.pdf; Supplier: LCSC; Type: 厚膜电阻; Tolerance: ±1%; Power(Watts): 100mW; Overload Voltage (Max): 75V; Temperature Coefficient: ±400ppm/℃; Operating Temperature Range: -55℃~+155℃
R24 R46-R50 R55-R62 = 0603WAF1000T5E: 电阻类型:厚膜电阻;阻值:100Ω;精度:±1%;功率:100mW;最大工作电压:75V;温度系数:±200ppm/℃;; LCSC Part Name: 100Ω ±1% 100mW 厚膜电阻; Supplier Part: C22775; Manufacturer: UNI-ROYAL(厚声); Supplier Footprint: 0603; JLCPCB Part Class: 基础库; Datasheet: https://atta.szlcsc.com/upload/public/pdf/source/20200306/C422600_1E6D84923E4A46A82E41ADD87F860B5C.pdf; Supplier: LCSC; Type: 厚膜电阻; Tolerance: ±1%; Power(Watts): 100mW; Overload Voltage (Max): 75V; Temperature Coefficient: ±200ppm/℃; Operating Temperature Range: -55℃~+155℃
R15 R17 R51 = 0603WAF1002T5E: 电阻类型:厚膜电阻;阻值:10kΩ;精度:±1%;功率:100mW;最大工作电压:75V;温度系数:±100ppm/℃;; LCSC Part Name: 厚膜电阻 10kΩ ±1% 100mW; Supplier Part: C25804; Manufacturer: UNI-ROYAL(厚声); Supplier Footprint: 0603; JLCPCB Part Class: 基础库; Datasheet: https://atta.szlcsc.com/upload/public/pdf/source/20200306/C422600_1E6D84923E4A46A82E41ADD87F860B5C.pdf; Supplier: LCSC; Type: 厚膜电阻; Tolerance: ±1%; Power(Watts): 100mW; Overload Voltage (Max): 75V; Temperature Coefficient: ±100ppm/℃; Operating Temperature Range: -55℃~+155℃
SW3 = DSWB02LHGET: 类型:平拨,凸起式;电路结构:单刀单掷;开关位数:2位;使用寿命:-;颜色:红色;; LCSC Part Name: 拨码开关,平拨开关,DSWB02LHGET; Supplier Part: C99421; Manufacturer: YE; Supplier Footprint: 插件; JLCPCB Part Class: 扩展库; Datasheet: https://atta.szlcsc.com/upload/public/pdf/source/20230906/EFD9230F686161BBBCD1B62855702D44.pdf; Supplier: LCSC; Type: 平拨,凸起式; Circuit: 单刀单掷; Number of Positions: 2位; Lead Pitch: 2.54mm; Color: 红色
U7 U13-U15 = ZX-ZH1.5-6PWT: 插针结构:1x6P;间距:1.5mm;安装方式:卧贴;参考系列:ZH;总PIN数:6P;排数:1;每排PIN数:6;行距:-;额定电流:1A;触头材质:黄铜;触头镀层:锡;工作温度:-25℃~+85℃;; LCSC Part Name: 1x6P 间距:1.5mm 卧贴 系列:ZH; Supplier Part: C19272409; Manufacturer: Megastar(兆星); Supplier Footprint: SMD,P=1.5mm,卧贴; JLCPCB Part Class: 扩展库; Datasheet: https://item.szlcsc.com/datasheet/ZX-ZH1.5-6PWT/20550420.html; Supplier: LCSC; Pins Structure: 1x6P; Pitch: 1.5mm; Mounting Type: 卧贴; Reference Series: ZH; Number of Pins: 6P; Number of Rows: 1; Number of PINs Per Row: 6; Current Rating: 1A; Contact Material: 黄铜; Contact Plating: 锡; Operating Temperature: -25℃~+85℃; Voltage Rating: 250V; Plastic Material: LCP; Supplementary Features: 辅助焊脚; Color: 米色; Z-Height of the Board: 3.8mm; X-Length of Bottom Edge on Board (Spacing Line): 12mm; Y-Width of Bottom Edge on Board: 6mm
U8-U11 = ZX-QC34-2TPDZ: 电路结构:单刀单掷;按钮形状:圆形按钮;作用力:2.6N;安装方式:立贴;开关长度:3mm;开关宽度:4mm;开关高度:2mm;带支架:不带支架;触点电流:50mA;额定电压:12V;机械寿命:10万次;; LCSC Part Name: 3*4*2贴片开关带柱; Supplier Part: C7470219; Manufacturer: Megastar(兆星); Supplier Footprint: SMD; JLCPCB Part Class: 扩展库; Datasheet: https://atta.szlcsc.com/upload/public/pdf/source/20230724/D2731FAADF93973E25928DE23F241F8A.pdf; Supplier: LCSC; Circuit: 单刀单掷; Actuator Style: 圆形按钮; Operating Force: 2.6N; Mounting Style: 立贴; Switch Length: 3mm; Switch Width: 4mm; Switch Height: 2mm; Strike Gundam: 不带支架; Contact Current: 50mA; Voltage Rating: 12V; Actuator/Cap Color: 黑色; Pin Style: 鸥翼型; Mechanical Life: 10万次; Operating Temperature: -30℃~+80℃
U20 U22-U24 = 42-51/GHC-YW2X2K/3T: 发光颜色:翠绿色;正向电流:-;主波长:520nm~535nm;发光强度:2850mcd;; LCSC Part Name: 正发光贴片灯 颜色正绿色 发光二极管; Supplier Part: C5136797; Manufacturer: EVERLIGHT(亿光); Supplier Footprint: 0603; JLCPCB Part Class: 扩展库; Datasheet: https://atta.szlcsc.com/upload/public/pdf/source/20220916/FBE88CF67A3FC292A254CF6ACE30EBDE.pdf; Supplier: LCSC; Emitted Color: 翠绿色; Dominant Wavelength: 520nm~535nm; Luminous Intensity: 2850mcd
U25 = HC-PM254-8.5H-2x4PZ-02A: 插孔结构:2x4P;间距:2.54mm;行距:2.54mm;圆孔/方孔:方孔;安装方式:直插;排数:双排;总孔位数:8P;额定电流:3A;额定电压:-;插孔方向:顶部;塑高:8.5mm;触头材质:黄铜;触头镀层:金;工作温度:-40℃~+105℃;; LCSC Part Name: 间距2.54mm 2x4Pin 直插 PC3.0 H8.5; Supplier Part: C22373909; Manufacturer: HC(虹成电子); Supplier Footprint: 插件,P=2.54mm; JLCPCB Part Class: 扩展库; Datasheet: https://item.szlcsc.com/datasheet/HC-PM254-8.5H-2x4PZ-02A/23870245.html; Supplier: LCSC; Holes Structure: 2x4P; Pitch: 2.54mm; Row Spacing: 2.54mm; Circular Hole / Square Hole: 方孔; Mounting Type: 直插; Number of Rows: 双排; Number of Positions: 8P; Current Rating: 3A; Holes Direction: 顶部; Insulation Height: 8.5mm; Contact Material: 黄铜; Contact Plating: 金; Operating Temperature: -40℃~+105℃; PIN Length: 3mm
U26 = MIMXRT1021xAGxA_CoreBoard
C3 = CC0603JRNPO9BN431: 容值:430pF;精度:±5%;额定电压:50V;材质(温度系数):NP0;; LCSC Part Name: 430pF ±5% 50V; Supplier Part: C309472; Manufacturer: YAGEO(国巨); Supplier Footprint: 0603; JLCPCB Part Class: 扩展库; Datasheet: https://atta.szlcsc.com/upload/public/pdf/source/20191125/C354976_4A9AE911FA5758D8C0A36AE6394FD4D7.pdf; Supplier: LCSC; Tolerance: ±5%; Voltage Rated: 50V; Temperature Coefficient: NP0
C16 = CL21B103KBANNNC: 容值:10nF;精度:±10%;额定电压:50V;材质(温度系数):X7R;; LCSC Part Name: 10nF ±10% 50V; Supplier Part: C1710; Manufacturer: SAMSUNG(三星); Supplier Footprint: 0805; JLCPCB Part Class: 基础库; Datasheet: https://atta.szlcsc.com/upload/public/pdf/source/20160218/1457707763339.pdf; Supplier: LCSC; Tolerance: ±10%; Voltage Rated: 50V; Temperature Coefficient: X7R
C17 = CL21A475KBQNNNE: 容值:4.7uF;精度:±10%;额定电压:50V;材质(温度系数):X5R;; LCSC Part Name: 4.7uF ±10% 50V; Supplier Part: C98192; Manufacturer: SAMSUNG(三星); Supplier Footprint: 0805; JLCPCB Part Class: 扩展库; Datasheet: https://atta.szlcsc.com/upload/public/pdf/source/20160218/1457707763339.pdf; Supplier: LCSC; Tolerance: ±10%; Voltage Rated: 50V; Temperature Coefficient: X5R
C21 C58 C59 = JVJ25V47M5x5: 容值:47uF;精度:±20%;额定电压:25V;纹波电流:35mA@120Hz;; LCSC Part Name: 47uF ±20% 25V; Supplier Part: C46550408; Manufacturer: JIERR(捷而瑞); Supplier Footprint: SMD,D5xL5.4mm; JLCPCB Part Class: 扩展库; Datasheet: https://item.szlcsc.com/datasheet/JVJ25V47M5x5/48680102.html; Supplier: LCSC; Tolerance: ±20%; Voltage Rating: 25V; Ripple Current: 35mA@120Hz; Diameter: 5mm; Height - Seated (Max): 5.4mm; Lifetime: 2000hrs@105℃; Operating Temperature: -55℃~+105℃
C25 C88 = CD288108M1V1020VFL: 容值:1000uF;额定电压:35V;; LCSC Part Name: 1000uF 35V; Supplier Part: C7499950; Manufacturer: HRK(鸿瑞凯电子); Supplier Footprint: 插件,D10xL20mm; JLCPCB Part Class: 扩展库; Datasheet: https://item.szlcsc.com/datasheet/CD288108M1V1020VFL/8575810.html; Supplier: LCSC; Voltage Rating: 35V; Diameter: 10mm; Height - Seated (Max): 20mm; Operating Temperature: -40℃~+105℃
C28 = CGA0805X5R106K250MT: 容值:10uF;精度:±10%;额定电压:25V;温度系数:X5R;; LCSC Part Name: 10uF ±10% 25V; Supplier Part: C6119887; Manufacturer: HRE(芯声); Supplier Footprint: 0805; JLCPCB Part Class: 扩展库; Datasheet: https://item.szlcsc.com/datasheet/CGA0805X5R106K250MT/7062593.html; Supplier: LCSC; Tolerance: ±10%; Voltage Rating: 25V; Temperature Coefficient: X5R
C56 C57 = JVJ25V220M6x8: 容值:220uF;精度:±20%;额定电压:25V;纹波电流:120mA@120Hz;; LCSC Part Name: 220uF ±20% 25V; Supplier Part: C46550404; Manufacturer: JIERR(捷而瑞); Supplier Footprint: SMD,D6.3xL7.7mm; JLCPCB Part Class: 扩展库; Datasheet: https://item.szlcsc.com/datasheet/JVJ25V220M6x8/48680098.html; Supplier: LCSC; Tolerance: ±20%; Voltage Rating: 25V; Ripple Current: 120mA@120Hz; Diameter: 6.3mm; Height - Seated (Max): 7.7mm; Lifetime: 2000hrs@105℃; Operating Temperature: -55℃~+105℃
CN3 = XT30PW-M30.G.Y: 类别:-;类型1:-;; LCSC Part Name: AMASS(艾迈斯)航模插头 卧式弯脚 XT30PW-M公头; Supplier Part: C431092; Manufacturer: AMASS(艾迈斯); JLCPCB Part Class: 扩展库; Datasheet: https://item.szlcsc.com/datasheet/XT30PW-M30.G.Y/426930.html; Supplier: LCSC; Type: 航模插头; RatedVoltage: DC 500V; InterfaceType: 公头; RatedCurrent: 15A; RecommendedWireGauge: 16/18/20AWG; contact resistance: 1.2mΩ; specifications: 2pin
D1 = BZT52C16S_C19077449: 二极管配置:独立式;稳压值(标称值):16V;稳压值(范围):15.3V~17.1V;耗散功率(Pd):200mW;; LCSC Part Name: 表面贴装齐纳二极管; Supplier Part: C19077449; Manufacturer: R+O(宏嘉诚); Supplier Footprint: SOD-323; JLCPCB Part Class: 扩展库; Datasheet: https://item.szlcsc.com/datasheet/BZT52C16S/20275534.html; Supplier: LCSC; Diode Configuration: 独立式; Zener Voltage(Nom): 16V; Reverse Leakage Current (Ir): 100nA; Zener Voltage(Range): 15.3V~17.1V; Pd - Power Dissipation: 200mW; Impedance(Zzt): 40Ω; Impedance(Zzk): 200Ω; Operating Junction Temperature Range: -55℃~+150℃
Q1 = HY19P03D: 类型:P沟道;漏源电压(Vdss):30V;连续漏极电流(Id):90A;功率(Pd):50W;导通电阻(RDS(on)@Vgs,Id):6mΩ@10V,45A;阈值电压(Vgs(th)@Id):3V@250uA;; LCSC Part Name: P沟道 耐压:30V 电流:90A; Supplier Part: C122492; Manufacturer: HUAYI(华羿微); Supplier Footprint: TO-252-2; Datasheet: https://atta.szlcsc.com/upload/public/pdf/source/20170728/C122492_1501225751911848809.pdf; Supplier: LCSC; Type: P沟道; Drain Source Voltage (Vdss): 30V; Continuous Drain Current (Id): 90A; Power Dissipation (Pd): 50W; Drain Source On Resistance (RDS(on)@Vgs,Id): 6mΩ@10V,45A; Gate Threshold Voltage (Vgs(th)@Id): 3V@250uA
R1 = FRC0603J103 TS: 电阻类型:厚膜电阻;阻值:10kΩ;精度:±5%;功率:100mW;工作电压:75V;温度系数:±100ppm/℃;; LCSC Part Name: 10kΩ ±5% 100mW 厚膜电阻; Supplier Part: C2930027; Manufacturer: FOJAN(富捷); Supplier Footprint: 0603; JLCPCB Part Class: 扩展库; Datasheet: https://item.szlcsc.com/datasheet/FRC0603J103%2520TS/3266960.html; Supplier: LCSC; Type: 厚膜电阻; Tolerance: ±5%; Power(Watts): 100mW; Voltage-Supply(Max): 75V; Temperature Coefficient: ±100ppm/℃; Operating Temperature: -55℃~+155℃
R2 R3 = 0603WAF1003T5E: 电阻类型:厚膜电阻;阻值:100kΩ;精度:±1%;功率:100mW;最大工作电压:75V;温度系数:±100ppm/℃;; LCSC Part Name: 100kΩ ±1% 100mW 厚膜电阻; Supplier Part: C25803; Manufacturer: UNI-ROYAL(厚声); Supplier Footprint: 0603; JLCPCB Part Class: 基础库; Datasheet: https://atta.szlcsc.com/upload/public/pdf/source/20200306/C422600_1E6D84923E4A46A82E41ADD87F860B5C.pdf; Supplier: LCSC; Type: 厚膜电阻; Tolerance: ±1%; Power(Watts): 100mW; Overload Voltage (Max): 75V; Temperature Coefficient: ±100ppm/℃; Operating Temperature Range: -55℃~+155℃
R4 = FRC0603F5233TS: 电阻类型:厚膜电阻;阻值:523kΩ;精度:±1%;功率:100mW;最大工作电压:75V;温度系数:±100ppm/℃;; LCSC Part Name: 523kΩ ±1% 100mW 厚膜电阻; Supplier Part: C5126197; Manufacturer: FOJAN(富捷); Supplier Footprint: 0603; JLCPCB Part Class: 扩展库; Datasheet: https://atta.szlcsc.com/upload/public/pdf/source/20211221/925EC7D7225764EE0046F22065062C87.pdf; Supplier: LCSC; Type: 厚膜电阻; Tolerance: ±1%; Power(Watts): 100mW; Overload Voltage (Max): 75V; Temperature Coefficient: ±100ppm/℃
R14 = FRC0603F3092TS: 电阻类型:厚膜电阻;阻值:30.9kΩ;精度:±1%;功率:100mW;最大工作电压:75V;温度系数:±100ppm/℃;; LCSC Part Name: 30.9kΩ ±1% 100mW 厚膜电阻; Supplier Part: C2930090; Manufacturer: FOJAN(富捷); Supplier Footprint: 0603; JLCPCB Part Class: 扩展库; Datasheet: https://atta.szlcsc.com/upload/public/pdf/source/20211221/925EC7D7225764EE0046F22065062C87.pdf; Supplier: LCSC; Type: 厚膜电阻; Tolerance: ±1%; Power(Watts): 100mW; Overload Voltage (Max): 75V; Temperature Coefficient: ±100ppm/℃; Operating Temperature Range: -55℃~+155℃
R16 = 0603WAF2701T5E: 电阻类型:厚膜电阻;阻值:2.7kΩ;精度:±1%;功率:100mW;最大工作电压:75V;温度系数:±100ppm/℃;; LCSC Part Name: 2.7kΩ ±1% 100mW 厚膜电阻; Supplier Part: C13167; Manufacturer: UNI-ROYAL(厚声); Supplier Footprint: 0603; JLCPCB Part Class: 基础库; Datasheet: https://atta.szlcsc.com/upload/public/pdf/source/20200306/C422600_1E6D84923E4A46A82E41ADD87F860B5C.pdf; Supplier: LCSC; Type: 厚膜电阻; Tolerance: ±1%; Power(Watts): 100mW; Overload Voltage (Max): 75V; Temperature Coefficient: ±100ppm/℃; Operating Temperature Range: -55℃~+155℃
SW2 = SS-12D10L5R: 拨动开关,立式直脚两档,插件,单排耐高温盐雾24小时,13x6.8x6.4平形红柄5mm; Supplier Part: C2884746; Manufacturer: XKB Connection(中国星坤); Supplier Footprint: 插件; JLCPCB Part Class: 扩展库; Datasheet: https://atta.szlcsc.com/upload/public/pdf/source/20240429/35867046E5074F55CDC419BEC7FAADDE.pdf; Supplier: LCSC
U12 = TPS82130SILR: TPS82130 TPS82130 具有集成电感的 3A 17V 降压转换器; Supplier Part: C473914; Manufacturer: TI(德州仪器); Supplier Footprint: USIP-8; JLCPCB Part Class: 扩展库; Datasheet: https://www.ti.com/cn/lit/gpn/tps82130; Supplier: LCSC
U19 = TPS7A8001DRBR: 输出类型:可调;最大输入电压:6.5V;输出电压:800mV~6V;输出电流:1A;电源纹波抑制比(PSRR):63dB;输出极性:正极;; LCSC Part Name: 具有低 IQ 和使能功能的 1A、高 PSRR、超低压降稳压器; Supplier Part: C105265; Manufacturer: TI(德州仪器); Supplier Footprint: VSON-8-EP(3x3); JLCPCB Part Class: 扩展库; Datasheet: https://www.ti.com/cn/lit/gpn/tps7a80; Supplier: LCSC; Output Type: 可调; Maximum Input Voltage: 6.5V; Output Voltage: 800mV~6V; Output Current: 1A; Power Supply Rejection Ratio (PSRR): 63dB; Dropout Voltage: 500mV@(1A); Feature: 防静电保护；软启动；浪涌保护；低ESR；热保护(TSD)；欠压闭锁；过流保护(OCP)；带使能; Output Polarity: 正极; Number of Outputs: 1
U21 = SY6280AAC: Supplier Part: C9900003867; Supplier Footprint: SOT-23-5; JLCPCB Part Class: 扩展库; Supplier: LCSC
U36 = RCA060RLF: 电阻类型:厚膜电阻;阻值:0Ω;功率:250mW;; LCSC Part Name: 0Ω 250mW; Supplier Part: C22356801; Manufacturer: HKR(香港电阻); Supplier Footprint: 1206; JLCPCB Part Class: 扩展库; Datasheet: https://item.szlcsc.com/datasheet/RCA060RLF/23790245.html; Supplier: LCSC; Type: 厚膜电阻; Power(Watts): 250mW; Operating Temperature: -55℃~+155℃

## Nets
GND: C20.1 C68.1 C69.1 C71.1 C72.1 C75.1 C76.1 C77.1 C78.1 C80.1 C81.1 C82.1 C83.1 C84.2 C85.2 C86.2 C87.2 C89.2 C90.2 C91.2 C92.2 CN1.7 CN1.8 CN2.2 H1.2 J1.2 P4.2 Q10.2(E) R5.1 R5.2 R19.2 R53.2 R58.1 R60.1 R68.2 R69.2 R70.1 R72.2 R73.2 R74.1 R75.1 R75.2 U2.5(GND) U2.12(IDRIVE) U2.14(EN) U2.16(GND) U2.25(EP) U3.1(1OE#) U3.4(2OE#) U3.7(GND) U3.8(3Y) U3.9(3A) U3.10(3OE#) U3.13(4OE#) U7.5 U8.2 U9.2 U10.2 U11.2 U13.5 U14.5 U15.5 U23.2(C) U24.2(C) U25.5 U25.6 U26.1(GND) U26.2(GND) U30.5(GND) U30.12(IDRIVE) U30.16(GND) U30.25(EP) U31.5(GND) U31.12(IDRIVE) U31.16(GND) U31.25(EP) U32.5(GND) U32.12(IDRIVE) U32.14(EN) U32.16(GND) U32.25(EP) U33.1(1OE#) U33.4(2OE#) U33.7(GND) U33.8(3Y) U33.9(3A) U33.10(3OE#) U33.13(4OE#) U36.1
PGND: C3.2 C16.1 C17.1 C19.1 C21.2 C25.2 C26.2 C28.2 C30.2 C32.2 C35.1 C56.2 C57.2 C58.2 C59.2 C88.2 C93.1 CN3.1(-) CN3.3 CN3.4 D4.2(A) D7.2(A) LED1.C LED2.C LED3.C LED4.C R1.1 R3.2 R15.1 R18.1 R81.1 R83.1 R84.1 R85.1 U2.20(SN) U12.3(GND) U12.9(EP) U19.4(GND) U19.9(EP) U20.2(C) U21.2(GND) U22.2(C) U30.20(SN) U31.20(SN) U32.20(SN) U36.2
VCC3V3: C17.2 C26.1 J1.4 P4.1 R14.2 R16.2 R20.1 R27.2 R28.2 R29.2 R30.2 R42.2 R43.2 U7.2 U13.2 U14.2 U15.2 U19.1(OUT) U19.2(OUT)
VCC5V: C21.1 C28.1 C30.1 C32.1 R2.1 R4.1 U12.4(VOUT) U12.5(VOUT) U19.7(IN) U19.8(IN) U21.5(IN) U26.5(5V) U26.6(5V)
VCC5V_EXT: C19.2 CN1.9 CN2.1 H1.1 R17.2 U21.1(OUT) U25.7
VCCBAT: C25.1 C35.2 C56.1 C57.1 C58.1 C59.1 C88.1 C93.2 D2.1(A) D3.1(A) D5.1(A) D6.1(A) Q1.2(D) Q22.3(D) Q24.3(D) Q27.3(D) Q28.3(D) Q30.3(D) Q33.3(D) Q34.3(D) Q36.3(D) R51.1 R89.1 R90.1 U12.1(EN) U12.2(VIN)
B3: CN1.6 U26.38(B3)
B4: CN1.10 U26.37(B4)
B5: J1.12 U26.36(B5)
B12: C89.1 R82.1 U26.29(B12)
B14: C90.1 R86.1 U26.27(B14)
B15: C91.1 R87.1 U26.26(B15)
B17: C92.1 R88.1 U26.24(B17)
B18: CN1.3 U26.23(B18)
B19: CN1.4 U26.22(B19)
B20: CN1.5 U26.21(B20)
B21: CN1.1 U26.20(B21)
B27: C20.2 R51.2 R53.1 U26.14(B27)
B28: J1.6 U26.13(B28)
B29: J1.14 U26.12(B29)
B30: J1.8 U26.11(B30)
B31: J1.10 U26.10(B31)
C0: U15.4 U26.78(C0)
C1: U15.3 U26.77(C1)
C2: U14.4 U26.76(C2)
C3: U14.3 U26.75(C3)
C5: U25.4 U26.73(C5)
C6: U25.1 U26.72(C6)
C7: U25.3 U26.71(C7)
C8: R47.2 U26.70(C8)
C9: R48.2 U26.69(C9)
C10: P4.3 U26.68(C10)
C11: P4.6 U26.67(C11)
C12: P4.4 U26.66(C12)
C13: P4.5 U26.65(C13)
C14: R49.2 U26.64(C14)
C15: R50.2 U26.63(C15)
C21: J1.16 U26.59(C21)
C28: R56.2 U26.52(C28)
C29: R55.1 U26.51(C29)
C30: R58.2 U26.50(C30)
C31: R57.1 U26.49(C31)
CR: U19.5(EN) U21.4(EN) U26.9(CR)
D0: H1.3 U26.48(D0)
D1: H1.4 U26.47(D1)
D2: H1.5 U26.46(D2)
D3: H1.6 U26.45(D3)
D4: R60.2 U26.44(D4)
D5: R59.1 U26.43(D5)
D6: R62.2 U26.42(D6)
D7: R61.1 U26.41(D7)
D8: R24.2 U26.40(D8)
D9: R46.2 U26.39(D9)
D13: U13.4 U26.90(D13)
D14: U13.3 U26.89(D14)
D15: U7.4 U26.88(D15)
D16: U7.3 U26.87(D16)
D20: CN2.4 U26.83(D20)
D21: CN2.3 U26.82(D21)
D24: R13.2 R19.1 U26.79(D24)
L_3V3: D4.1(K) R89.2 R92.2 U5.3 U5.6
L_B_A: Q30.2(S) Q31.3(D) U2.23(SH2) U7.6
L_B_B: Q34.2(S) Q35.3(D) U2.18(SH1) U7.1
L_B_PH: U2.15(PH) U3.11(4Y)
L_B_PH_IN: R59.2 R70.2 U3.12(4A)
L_DVDD: C69.2 U3.14(VCC) U30.8(DVDD)
L_F_A: Q32.3(D) Q33.2(S) U13.6 U30.23(SH2)
L_F_B: Q36.2(S) Q37.3(D) U13.1 U30.18(SH1)
L_F_EN: U3.6(2Y) U30.14(EN)
L_F_EN_IN: R62.1 R69.1 U3.5(2A)
L_F_PH: U3.3(1Y) U30.15(PH)
L_F_PH_IN: R61.2 R68.1 U3.2(1A)
L_NSLEEP: R93.1 U2.13(nSLEEP) U5.2 U5.5 U30.13(nSLEEP)
R_3V3: D7.1(K) R90.2 R91.2 U34.3 U34.6
R_B_A: Q28.2(S) Q29.3(D) U14.6 U32.23(SH2)
R_B_B: Q26.3(D) Q27.2(S) U14.1 U32.18(SH1)
R_B_PH: U32.15(PH) U33.11(4Y)
R_B_PH_IN: R57.2 R74.2 U33.12(4A)
R_DVDD: C76.2 U31.8(DVDD) U33.14(VCC)
R_F_A: Q22.2(S) Q23.3(D) U15.6 U31.23(SH2)
R_F_B: Q24.2(S) Q25.3(D) U15.1 U31.18(SH1)
R_F_EN: U31.14(EN) U33.6(2Y)
R_F_EN_IN: R56.1 R73.1 U33.5(2A)
R_F_PH: U31.15(PH) U33.3(1Y)
R_F_PH_IN: R55.2 R72.1 U33.2(1A)
R_NSLEEP: R94.1 U31.13(nSLEEP) U32.13(nSLEEP) U34.2 U34.5
$1N2611: D1.2(A) R1.2 SW2.3
$1N2612: Q1.1(G) SW2.2
$1N2614: CN3.2(+) D1.1(K) Q1.3(S) SW2.1
$1N2619: C3.1 U12.8(SS/TR)
$1N2621: R3.1 R4.2 U12.6(FB)
$1N2622: R2.2 U12.7(PG)
$1N2632: C16.2 U19.6(NR)
$1N2633: R14.1 R15.2 U19.3(FB/SNS)
$1N2637: R16.1 U20.1(A)
$1N2640: R17.1 U22.1(A)
$1N2643: R18.2 U21.3(ISET)
$2N2637: BUZZER1.1(+) R20.2
$2N2638: BUZZER1.2(-) Q10.3(C)
$2N2639: Q10.1(B) R13.1
$2N2664: R24.1 R42.1 SW3.2
$2N2665: R43.1 R46.1 SW3.1
$2N2666: SW3.4 U24.1(A)
$2N2667: SW3.3 U23.1(A)
$2N2669: R27.1 R47.1 U8.1
$2N2670: R28.1 R48.1 U9.1
$2N2671: R29.1 R49.1 U10.1
$2N2672: R30.1 R50.1 U11.1
$4N2118: C64.2 U30.4(CPL)
$4N2119: C64.1 U30.3(CPH)
$4N2120: C70.1 U30.2(VCP)
$4N2128: Q33.1(G) U30.24(GH2)
$4N2129: Q32.1(G) U30.22(GL2)
$4N2130: Q37.1(G) U30.19(GL1)
$4N2131: Q36.1(G) U30.17(GH1)
$4N2134: C72.2 U2.6(VREF) U2.7(AVDD)
$4N2135: C65.2 U2.4(CPL)
$4N2136: C65.1 U2.3(CPH)
$4N2137: C73.1 U2.2(VCP)
$4N2145: Q30.1(G) U2.24(GH2)
$4N2146: Q31.1(G) U2.22(GL2)
$4N2147: Q35.1(G) U2.19(GL1)
$4N2148: Q34.1(G) U2.17(GH1)
$4N2157: C71.2 U2.8(DVDD)
$4N2176: LED1.A R93.2
$4N2212: C70.2 C83.2 C84.1 D2.2(C) U30.1(VM)
$4N2213: C73.2 C82.2 C85.1 D3.2(C) U2.1(VM)
$4N6181: C66.2 U31.4(CPL)
$4N6182: C66.1 U31.3(CPH)
$4N6183: C74.1 U31.2(VCP)
$4N6191: Q22.1(G) U31.24(GH2)
$4N6192: Q23.1(G) U31.22(GL2)
$4N6193: Q25.1(G) U31.19(GL1)
$4N6194: Q24.1(G) U31.17(GH1)
$4N6198: C67.2 U32.4(CPL)
$4N6199: C67.1 U32.3(CPH)
$4N6200: C79.1 U32.2(VCP)
$4N6208: Q28.1(G) U32.24(GH2)
$4N6209: Q29.1(G) U32.22(GL2)
$4N6210: Q26.1(G) U32.19(GL1)
$4N6211: Q27.1(G) U32.17(GH1)
$4N6224: C77.2 U32.8(DVDD)
$4N6243: LED3.A R94.2
$4N6255: C74.2 C81.2 C86.1 D5.2(C) U31.1(VM)
$4N6256: C79.2 C80.2 C87.1 D6.2(C) U32.1(VM)
$4N17348: R82.2 U31.11(SO)
$4N17666: C75.2 U31.6(VREF) U31.7(AVDD)
$4N18963: C78.2 U32.6(VREF) U32.7(AVDD)
$4N18967: R86.2 U32.11(SO)
$4N19034: R87.2 U2.11(SO)
$4N19043: C68.2 U30.6(VREF) U30.7(AVDD)
$4N19047: R88.2 U30.11(SO)
$4N19238: LED4.A R91.1
$4N19277: LED2.A R92.1
Net-(Q23-2): Q23.2(S) Q25.2(S) R81.2 U31.21(SP)
Net-(Q26-2): Q26.2(S) Q29.2(S) R83.2 U32.21(SP)
Net-(Q31-2): Q31.2(S) Q35.2(S) R84.2 U2.21(SP)
Net-(Q32-2): Q32.2(S) Q37.2(S) R85.2 U30.21(SP)

Not connected (* = marked no-connect by the designer): CN1 2*; J1 1* 3* 5* 7* 9* 11* 13* 15*; U2 9(nFAULT)* 10(SNSOUT)*; U5 1* 4*; U7 7* 8*; U13 7* 8*; U14 7* 8*; U15 7* 8*; U25 2* 8*; U26 3(3V3)* 4(3V3)* 7(OF)* 8(WU)* 15(B26)* 16(B25)* 17(B24)* 18(B23)* 19(B22)* 25(B16)* 28(B13)* 30(B11)* 31(B10)* 32(B9)* 33(B8)* 34(B7)* 35(B6)* 53(C27)* 54(C26)* 55(C25)* 56(C24)* 57(C23)* 58(C22)* 60(C20)* 61(C19)* 62(C18)* 74(C4)* 80(D23)* 81(D22)* 84(D19)* 85(D18)* 86(D17)*; U30 9(nFAULT)* 10(SNSOUT)*; U31 9(nFAULT)* 10(SNSOUT)*; U32 9(nFAULT)* 10(SNSOUT)*; U34 1* 4*

## Notes on the sheets
sheet 1
- 5V上电时序控制开关
- 电源接口
- 5V电源
- 单点接地（功率地和数字地）
- 3V3电源
sheet 2
- 屏幕
- 姿态传感器
- ToF传感器
- 无线串口
- 驱动信号右
- 电压检测
- openart
- 蜂鸣器
- 使用反向线
- 驱动信号左
- SPI-WIFI
- 拨码开关
- 轻触开关
- 编码器/电机
sheet 4
- 右电机驱动电路（前）
- 右电机驱动电路（后）
- 左电机驱动电路（前）
- 左电机驱动电路（后）
- 缓冲电路
- 使能开关
- 电源指示
- 缓冲电路
- 使能开关
- 电源指示
